# EAGLE design Cirrus (EAGLE 8.6.0)

## Sheet 1 of 4
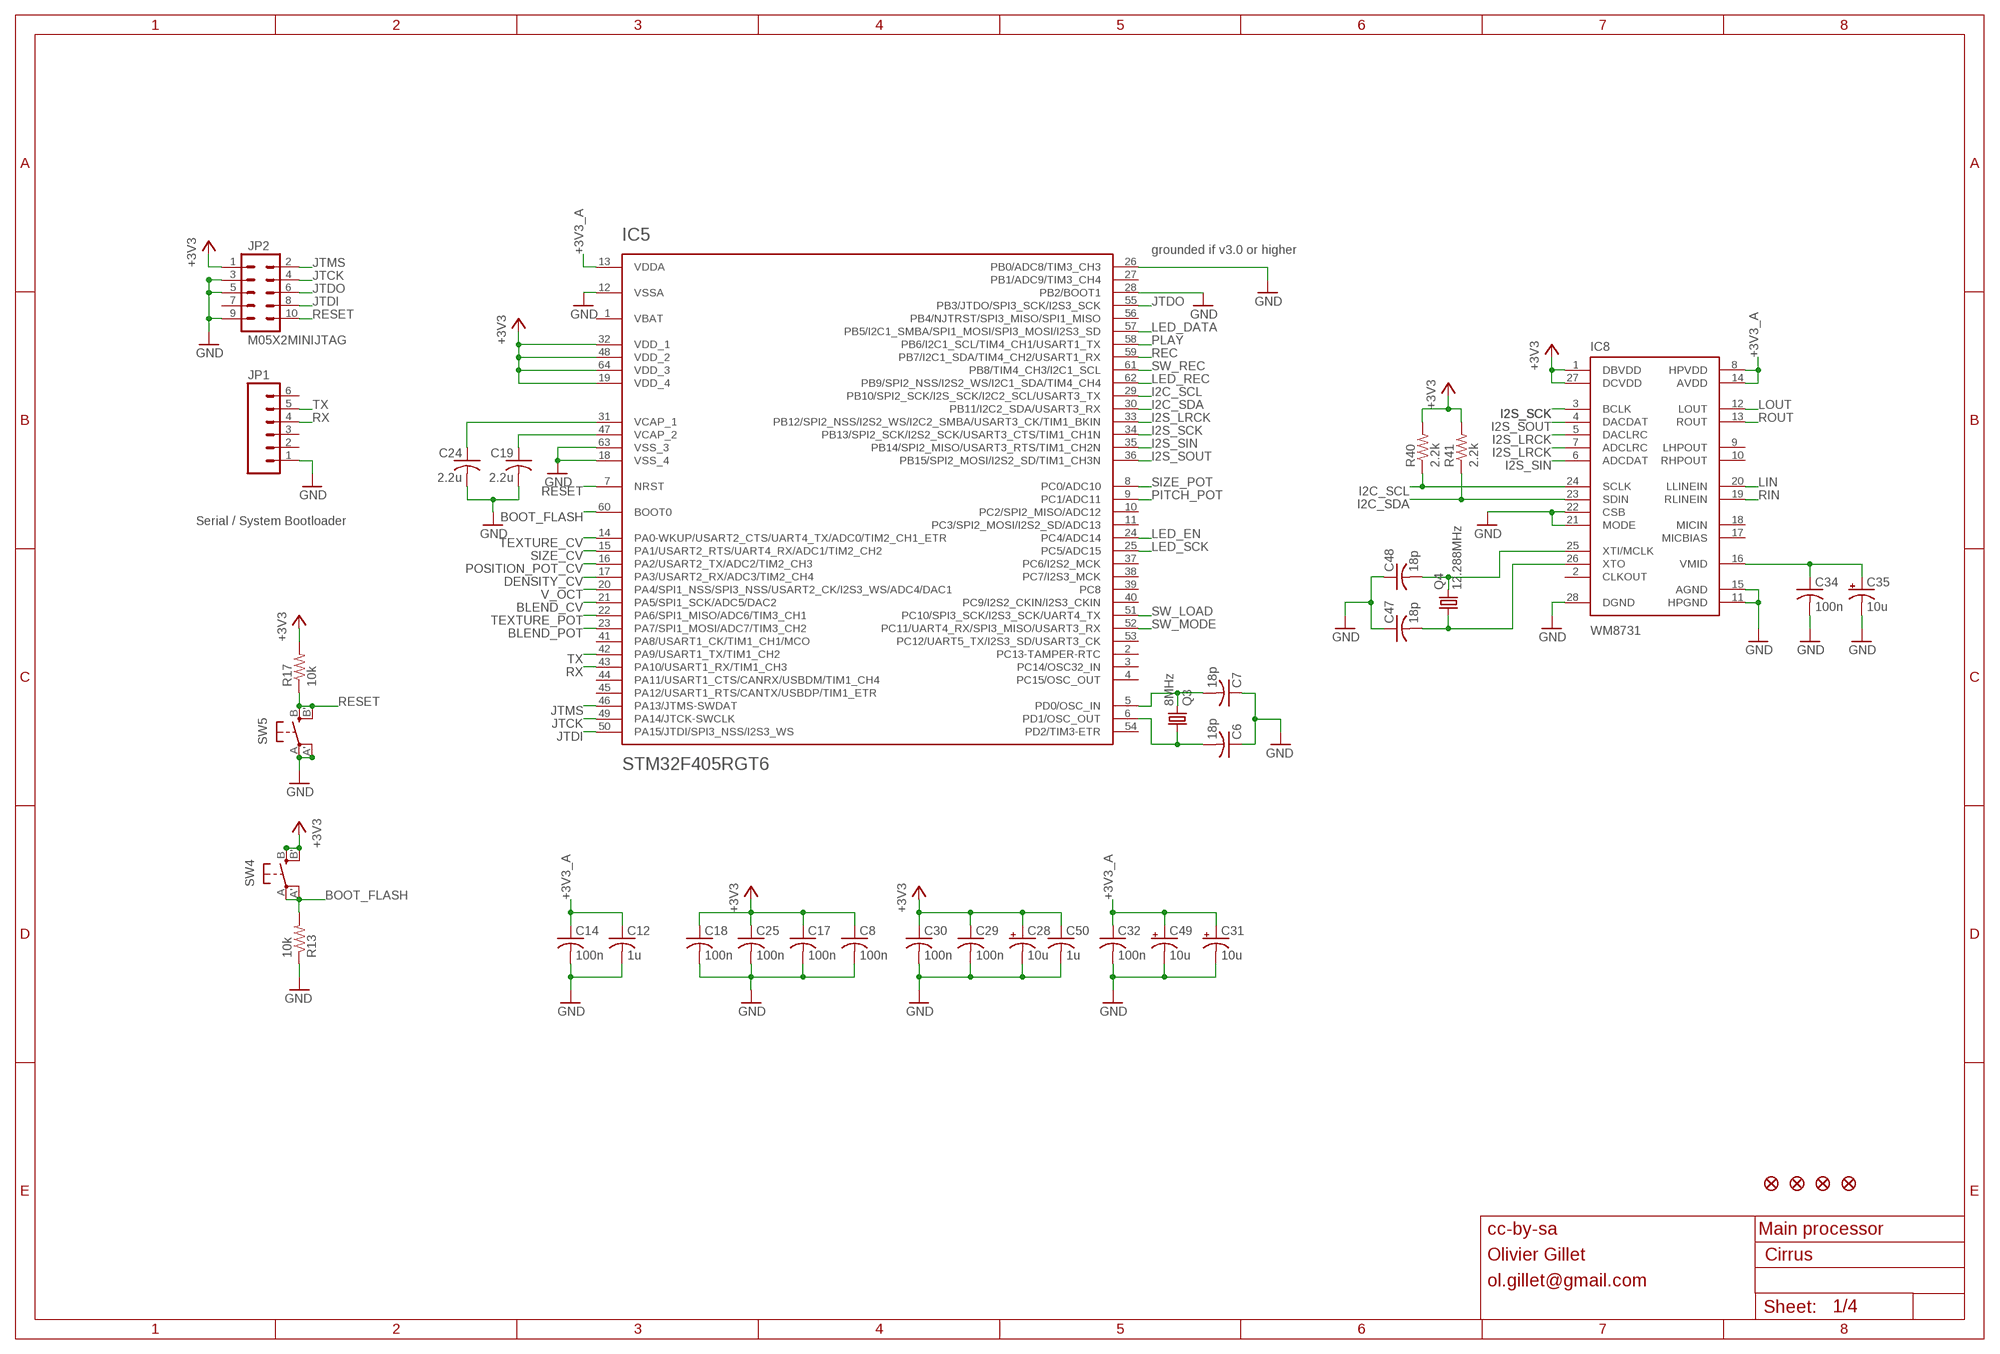
[diagram p0: schematic, sheet 1]

### Parts
C6  18p  C-USC0603  [C0603]
C7  18p  C-USC0603  [C0603]
C8  100n  C-USC0603  [C0603]
C12  1u  C-USC0603  [C0603]
C14  100n  C-USC0603  [C0603]
C17  100n  C-USC0603  [C0603]
C18  100n  C-USC0603  [C0603]
C19  2.2u  C-USC0805  [C0805]
C24  2.2u  C-USC0805  [C0805]
C25  100n  C-USC0603  [C0603]
C28  10u  CPOL-USB  [PANASONIC_B]
C29  100n  C-USC0603  [C0603]
C30  100n  C-USC0603  [C0603]
C31  10u  CPOL-USB  [PANASONIC_B]
C32  100n  C-USC0603  [C0603]
C34  100n  C-USC0603  [C0603]
C35  10u  CPOL-USB  [PANASONIC_B]
C47  18p  C-USC0603  [C0603]
C48  18p  C-USC0603  [C0603]
C49  10u  CPOL-USB  [PANASONIC_B]
C50  1u  C-USC0603  [C0603]
F1  FIDUCIAL1X2  [FIDUCIAL-1X2]
F2  FIDUCIAL1X2  [FIDUCIAL-1X2]
F3  FIDUCIAL1X2  [FIDUCIAL-1X2]
F4  FIDUCIAL1X2  [FIDUCIAL-1X2]
IC5  STM32F405RGT6  STM32F20X  [TQFP-10X10-64]
IC8  WM8731  [SSOP28]
JP1  M06SIP  [1X06]
JP2  M05X2MINIJTAG  [2X5-1.27]
Q3  8MHz  CRYSTALHC49UP  [HC49UP]
Q4  12.288MHz  CRYSTALHC49UP  [HC49UP]
R13  10k  R-US_R0603  [R0603]
R17  10k  R-US_R0603  [R0603]
R40  2.2k  R-US_R0603  [R0603]
R41  2.2k  R-US_R0603  [R0603]
SW4  EVQQ2  [EVQ-Q2]
SW5  EVQQ2  [EVQ-Q2]

### Nets
+3V3: C8.1 C17.1 C18.1 C25.1 C28.+ C29.1 C30.1 C50.1 IC5.19(VDD_4) IC5.32(VDD_1) IC5.48(VDD_2) IC5.64(VDD_3) IC8.1(DBVDD) IC8.27(DCVDD) JP2.1 R17.2 R40.2 R41.2 SW4.B'(S1) SW4.B(S) ; also sheet 3,4
+3V3_A: C12.1 C14.1 C31.+ C32.1 C49.+ IC5.13(VDDA) IC8.8(HPVDD) IC8.14(AVDD) ; also sheet 2,3,4
BLEND_CV: IC5.21(PA5/SPI1_SCK/ADC5/DAC2) ; also sheet 2
BLEND_POT: IC5.23(PA7/SPI1_MOSI/ADC7/TIM3_CH2) ; also sheet 3
BOOT_FLASH: IC5.60(BOOT0) R13.2 SW4.A'(P1) SW4.A(P)
DENSITY_CV: IC5.17(PA3/USART2_RX/ADC3/TIM2_CH4) ; also sheet 2
GND: C6.1 C7.1 C8.2 C12.2 C14.2 C17.2 C18.2 C19.2 C24.2 C25.2 C28.- C29.2 C30.2 C31.- C32.2 C34.2 C35.- C47.1 C48.1 C49.- C50.2 IC5.12(VSSA) IC5.18(VSS_4) IC5.26(PB0/ADC8/TIM3_CH3) IC5.28(PB2/BOOT1) IC5.63(VSS_3) IC8.11(HPGND) IC8.15(AGND) IC8.21(MODE) IC8.22(CSB) IC8.28(DGND) JP1.1 JP2.3 JP2.5 JP2.9 R13.1 SW5.A'(P1) SW5.A(P) ; also sheet 2,3,4
I2C_SCL: IC5.29(PB10/SPI2_SCK/I2S_SCK/I2C2_SCL/USART3_TX) IC8.24(SCLK) R40.1
I2C_SDA: IC5.30(PB11/I2C2_SDA/USART3_RX) IC8.23(SDIN) R41.1
I2S_LRCK: IC5.33(PB12/SPI2_NSS/I2S2_WS/I2C2_SMBA/USART3_CK/TIM1_BKIN) IC8.5(DACLRC) IC8.7(ADCLRC)
I2S_SCK: IC5.34(PB13/SPI2_SCK/I2S2_SCK/USART3_CTS/TIM1_CH1N) IC8.3(BCLK)
I2S_SIN: IC5.35(PB14/SPI2_MISO/USART3_RTS/TIM1_CH2N) IC8.6(ADCDAT)
I2S_SOUT: IC5.36(PB15/SPI2_MOSI/I2S2_SD/TIM1_CH3N) IC8.4(DACDAT)
JTCK: IC5.49(PA14/JTCK-SWCLK) JP2.4
JTDI: IC5.50(PA15/JTDI/SPI3_NSS/I2S3_WS) JP2.8
JTDO: IC5.55(PB3/JTDO/SPI3_SCK/I2S3_SCK) JP2.6
JTMS: IC5.46(PA13/JTMS-SWDAT) JP2.2
LED_DATA: IC5.57(PB5/I2C1_SMBA/SPI1_MOSI/SPI3_MOSI/I2S3_SD) ; also sheet 3
LED_EN: IC5.24(PC4/ADC14) ; also sheet 3
LED_REC: IC5.62(PB9/SPI2_NSS/I2S2_WS/I2C1_SDA/TIM4_CH4) ; also sheet 3
LED_SCK: IC5.25(PC5/ADC15) ; also sheet 3
LIN: IC8.20(LLINEIN) ; also sheet 2
LOUT: IC8.12(LOUT) ; also sheet 2
N$7: C7.2 IC5.5(PD0/OSC_IN) Q3.2
N$8: C6.2 IC5.6(PD1/OSC_OUT) Q3.1
N$13: C19.1 IC5.47(VCAP_2)
N$17: C34.1 C35.+ IC8.16(VMID)
N$19: C24.1 IC5.31(VCAP_1)
N$59: C47.2 IC8.26(XTO) Q4.1
N$60: C48.2 IC8.25(XTI/MCLK) Q4.2
PITCH_POT: IC5.9(PC1/ADC11) ; also sheet 3
PLAY: IC5.58(PB6/I2C1_SCL/TIM4_CH1/USART1_TX) ; also sheet 3
POSITION_POT_CV: IC5.16(PA2/USART2_TX/ADC2/TIM2_CH3) ; also sheet 2
REC: IC5.59(PB7/I2C1_SDA/TIM4_CH2/USART1_RX) ; also sheet 3
RESET: IC5.7(NRST) JP2.10 R17.1 SW5.B'(S1) SW5.B(S)
RIN: IC8.19(RLINEIN) ; also sheet 2
ROUT: IC8.13(ROUT) ; also sheet 2
RX: IC5.43(PA10/USART1_RX/TIM1_CH3) JP1.4
SIZE_CV: IC5.15(PA1/USART2_RTS/UART4_RX/ADC1/TIM2_CH2) ; also sheet 2
SIZE_POT: IC5.8(PC0/ADC10) ; also sheet 3
SW_LOAD: IC5.51(PC10/SPI3_SCK/I2S3_SCK/UART4_TX) ; also sheet 3
SW_MODE: IC5.52(PC11/UART4_RX/SPI3_MISO/USART3_RX) ; also sheet 3
SW_REC: IC5.61(PB8/TIM4_CH3/I2C1_SCL) ; also sheet 3
TEXTURE_CV: IC5.14(PA0-WKUP/USART2_CTS/UART4_TX/ADC0/TIM2_CH1_ETR) ; also sheet 2
TEXTURE_POT: IC5.22(PA6/SPI1_MISO/ADC6/TIM3_CH1) ; also sheet 3
TX: IC5.42(PA9/USART1_TX/TIM1_CH2) JP1.5
V_OCT: IC5.20(PA4/SPI1_NSS/SPI3_NSS/USART2_CK/I2S3_WS/ADC4/DAC1) ; also sheet 2
Unconnected: IC5.2(PC13-TAMPER-RTC) IC5.3(PC14/OSC32_IN) IC5.4(PC15/OSC_OUT) IC5.10(PC2/SPI2_MISO/ADC12) IC5.11(PC3/SPI2_MOSI/I2S2_SD/ADC13) IC5.27(PB1/ADC9/TIM3_CH4) IC5.37(PC6/I2S2_MCK) IC5.38(PC7/I2S3_MCK) IC5.39(PC8) IC5.40(PC9/I2S2_CKIN/I2S3_CKIN) IC5.41(PA8/USART1_CK/TIM1_CH1/MCO) IC5.44(PA11/USART1_CTS/CANRX/USBDM/TIM1_CH4) IC5.45(PA12/USART1_RTS/CANTX/USBDP/TIM1_ETR) IC5.53(PC12/UART5_TX/I2S3_SD/USART3_CK) IC5.54(PD2/TIM3-ETR) IC5.56(PB4/NJTRST/SPI3_MISO/SPI1_MISO) IC8.2(CLKOUT) IC8.9(LHPOUT) IC8.10(RHPOUT) IC8.17(MICBIAS) IC8.18(MICIN) JP1.2 JP1.3 JP1.6 JP2.7

### Notes on the sheet
- grounded if v3.0 or higher
- Serial / System Bootloader
- cc-by-sa | Main processor
- Olivier Gillet
- ol.gillet@gmail.com

## Sheet 2 of 4
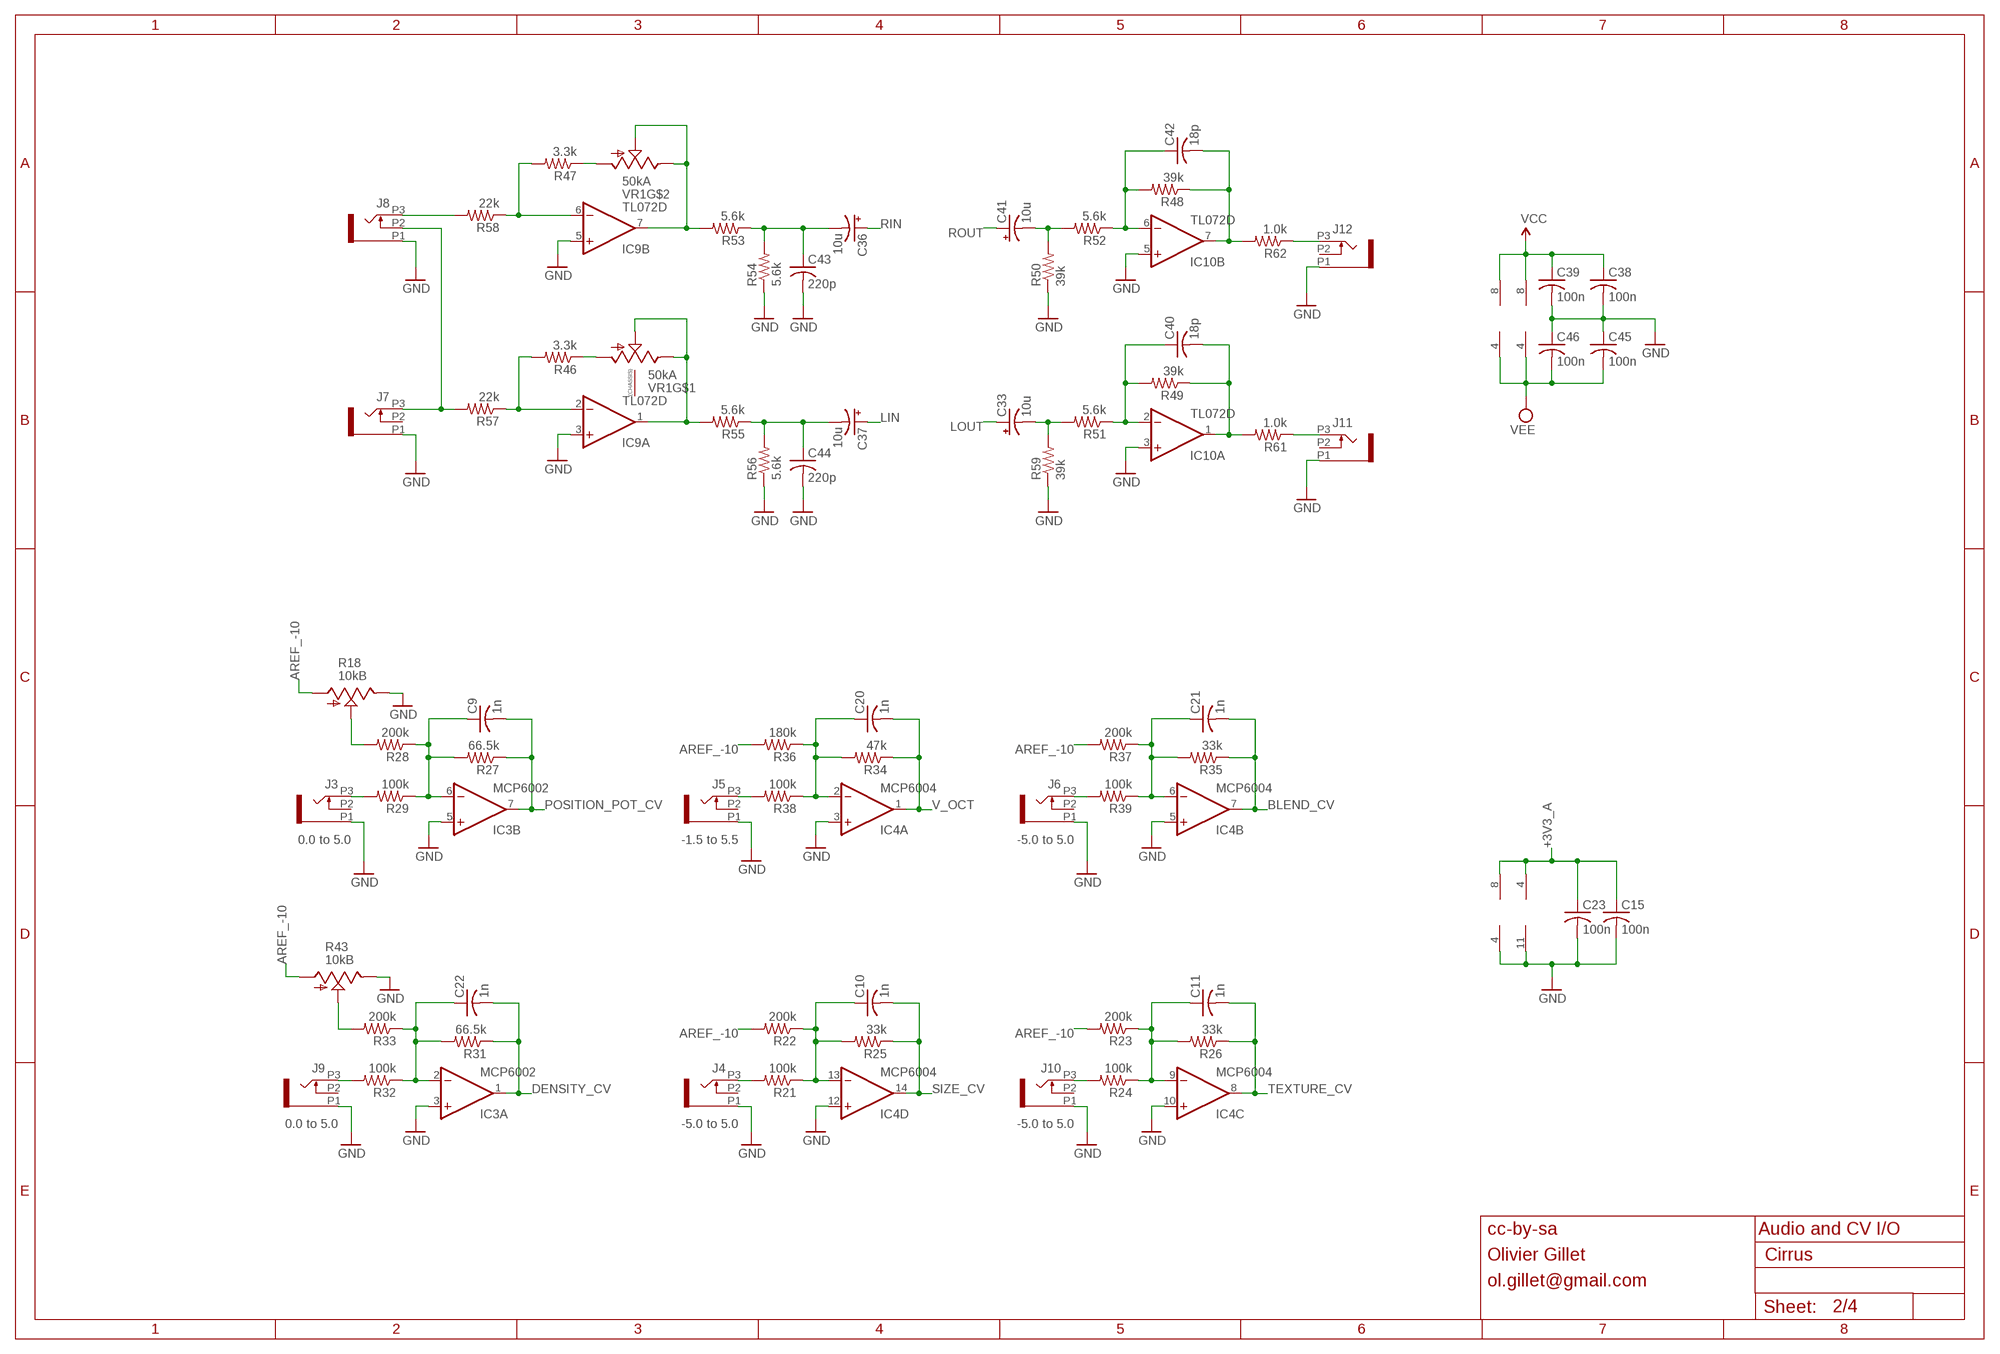
[diagram p1: schematic, sheet 2]

### Parts
C9  1n  C-USC0603  [C0603]
C10  1n  C-USC0603  [C0603]
C11  1n  C-USC0603  [C0603]
C15  100n  C-USC0603  [C0603]
C20  1n  C-USC0603  [C0603]
C21  1n  C-USC0603  [C0603]
C22  1n  C-USC0603  [C0603]
C23  100n  C-USC0603  [C0603]
C33  10u  CPOL-USB  [PANASONIC_B]
C36  10u  CPOL-USB  [PANASONIC_B]
C37  10u  CPOL-USB  [PANASONIC_B]
C38  100n  C-USC0603  [C0603]
C39  100n  C-USC0603  [C0603]
C40  18p  C-USC0603  [C0603]
C41  10u  CPOL-USB  [PANASONIC_B]
C42  18p  C-USC0603  [C0603]
C43  220p  C-USC0603  [C0603]
C44  220p  C-USC0603  [C0603]
C45  100n  C-USC0603  [C0603]
C46  100n  C-USC0603  [C0603]
IC3  MCP6002  TL072D  [SO08]
IC4  MCP6004  TL074D  [SO14]
IC9  TL072D  [SO08]
IC10  TL072D  [SO08]
J3  PJ301_THONKICONN6  [WQP_PJ_301M6]
J4  PJ301_THONKICONN6  [WQP_PJ_301M6]
J5  PJ301_THONKICONN6  [WQP_PJ_301M6]
J6  PJ301_THONKICONN6  [WQP_PJ_301M6]
J7  PJ301_THONKICONN6  [WQP_PJ_301M6]
J8  PJ301_THONKICONN6  [WQP_PJ_301M6]
J9  PJ301_THONKICONN6  [WQP_PJ_301M6]
J10  PJ301_THONKICONN6  [WQP_PJ_301M6]
J11  PJ301_THONKICONN6  [WQP_PJ_301M6]
J12  PJ301_THONKICONN6  [WQP_PJ_301M6]
R18  10kB  POT_USVERTICAL_PS  [ALPS_POT_VERTICAL_PS]
R21  100k  R-US_R0603  [R0603]
R22  200k  R-US_R0603  [R0603]
R23  200k  R-US_R0603  [R0603]
R24  100k  R-US_R0603  [R0603]
R25  33k  R-US_R0603  [R0603]
R26  33k  R-US_R0603  [R0603]
R27  66.5k  R-US_R0603  [R0603]
R28  200k  R-US_R0603  [R0603]
R29  100k  R-US_R0603  [R0603]
R31  66.5k  R-US_R0603  [R0603]
R32  100k  R-US_R0603  [R0603]
R33  200k  R-US_R0603  [R0603]
R34  47k  R-US_R0603  [R0603]
R35  33k  R-US_R0603  [R0603]
R36  180k  R-US_R0603  [R0603]
R37  200k  R-US_R0603  [R0603]
R38  100k  R-US_R0603  [R0603]
R39  100k  R-US_R0603  [R0603]
R43  10kB  POT_USVERTICAL_PS  [ALPS_POT_VERTICAL_PS]
R46  3.3k  R-US_R0603  [R0603]
R47  3.3k  R-US_R0603  [R0603]
R48  39k  R-US_R0603  [R0603]
R49  39k  R-US_R0603  [R0603]
R50  39k  R-US_R0603  [R0603]
R51  5.6k  R-US_R0603  [R0603]
R52  5.6k  R-US_R0603  [R0603]
R53  5.6k  R-US_R0603  [R0603]
R54  5.6k  R-US_R0603  [R0603]
R55  5.6k  R-US_R0603  [R0603]
R56  5.6k  R-US_R0603  [R0603]
R57  22k  R-US_R0603  [R0603]
R58  22k  R-US_R0603  [R0603]
R59  39k  R-US_R0603  [R0603]
R61  1.0k  R-US_R0603  [R0603]
R62  1.0k  R-US_R0603  [R0603]
VR1  50kA  ALPHA-9MM-DUALPOT  [DUAL_9MM_SNAP-IN_POT]

### Nets
+3V3_A: C15.1 C23.1 IC3.8(P:V+) IC4.4(P:V+) ; also sheet 1,3,4
AREF_-10: R18.P$3(A) R22.2 R23.2 R36.2 R37.2 R43.P$3(A) ; also sheet 4
BLEND_CV: C21.2 IC4.7(B:OUT) R35.1 ; also sheet 1
DENSITY_CV: C22.2 IC3.1(A:OUT) R31.1 ; also sheet 1
GND: C15.2 C23.2 C38.2 C39.2 C43.2 C44.2 C45.1 C46.1 IC3.3(A:+IN) IC3.4(P:V-) IC3.5(B:+IN) IC4.3(A:+IN) IC4.5(B:+IN) IC4.10(C:+IN) IC4.11(P:V-) IC4.12(D:+IN) IC9.3(A:+IN) IC9.5(B:+IN) IC10.3(A:+IN) IC10.5(B:+IN) J3.P1 J4.P1 J5.P1 J6.P1 J7.P1 J8.P1 J9.P1 J10.P1 J11.P1 J12.P1 R18.P$1(E) R43.P$1(E) R50.1 R54.1 R56.1 R59.1 ; also sheet 1,3,4
LIN: C37.+ ; also sheet 1
LOUT: C33.+ ; also sheet 1
LOUT_JACK: J11.P3 R61.1
N$1: J4.P3 R21.2
N$2: C10.1 IC4.13(D:-IN) R21.1 R22.1 R25.2
N$3: R47.1 VR1.1B(A)
N$4: J10.P3 R24.2
N$5: C11.1 IC4.9(C:-IN) R23.1 R24.1 R26.2
N$6: J6.P3 R39.2
N$10: J5.P3 R38.2
N$11: C20.1 IC4.2(A:-IN) R34.2 R36.1 R38.1
N$14: J9.P3 R32.2
N$15: C21.1 IC4.6(B:-IN) R35.2 R37.1 R39.1
N$18: C37.- C44.1 R55.1 R56.2
N$20: J8.P3 R58.2
N$21: J7.P3 J8.P2 R57.2
N$22: C36.- C43.1 R53.1 R54.2
N$23: C41.- R50.2 R52.2
N$24: C22.1 IC3.2(A:-IN) R31.2 R32.1 R33.1
N$25: C42.1 IC10.6(B:-IN) R48.2 R52.1
N$26: R33.2 R43.P$2(S)
N$27: J3.P3 R29.2
N$28: C42.2 IC10.7(B:OUT) R48.1 R62.2
N$30: C9.1 IC3.6(B:-IN) R27.2 R28.1 R29.1
N$31: C33.- R51.2 R59.2
N$32: C40.1 IC10.2(A:-IN) R49.2 R51.1
N$33: C40.2 IC10.1(A:OUT) R49.1 R61.2
N$35: R18.P$2(S) R28.2
N$42: IC9.7(B:OUT) R53.2 VR1.2B(S) VR1.3B(E)
N$51: IC9.1(A:OUT) R55.2 VR1.2(S) VR1.3(E)
N$52: R46.1 VR1.1(A)
N$54: IC9.6(B:-IN) R47.2 R58.1
N$58: IC9.2(A:-IN) R46.2 R57.1
POSITION_POT_CV: C9.2 IC3.7(B:OUT) R27.1 ; also sheet 1
RIN: C36.+ ; also sheet 1
ROUT: C41.+ ; also sheet 1
ROUT_JACK: J12.P3 R62.1
SIZE_CV: C10.2 IC4.14(D:OUT) R25.1 ; also sheet 1
TEXTURE_CV: C11.2 IC4.8(C:OUT) R26.1 ; also sheet 1
V_OCT: C20.2 IC4.1(A:OUT) R34.1 ; also sheet 1
VCC: C38.1 C39.1 IC9.8(P:V+) IC10.8(P:V+) ; also sheet 4
VEE: C45.2 C46.2 IC9.4(P:V-) IC10.4(P:V-) ; also sheet 4
Unconnected: J3.P2 J4.P2 J5.P2 J6.P2 J7.P2 J9.P2 J10.P2 J11.P2 J12.P2 VR1.CHASSIS1 VR1.CHASSIS2

### Notes on the sheet
- 0.0 to 5.0 | -1.5 to 5.5 | -5.0 to 5.0
- 0.0 to 5.0 | -5.0 to 5.0 | -5.0 to 5.0
- cc-by-sa | Audio and CV I/O
- Olivier Gillet
- ol.gillet@gmail.com

## Sheet 3 of 4
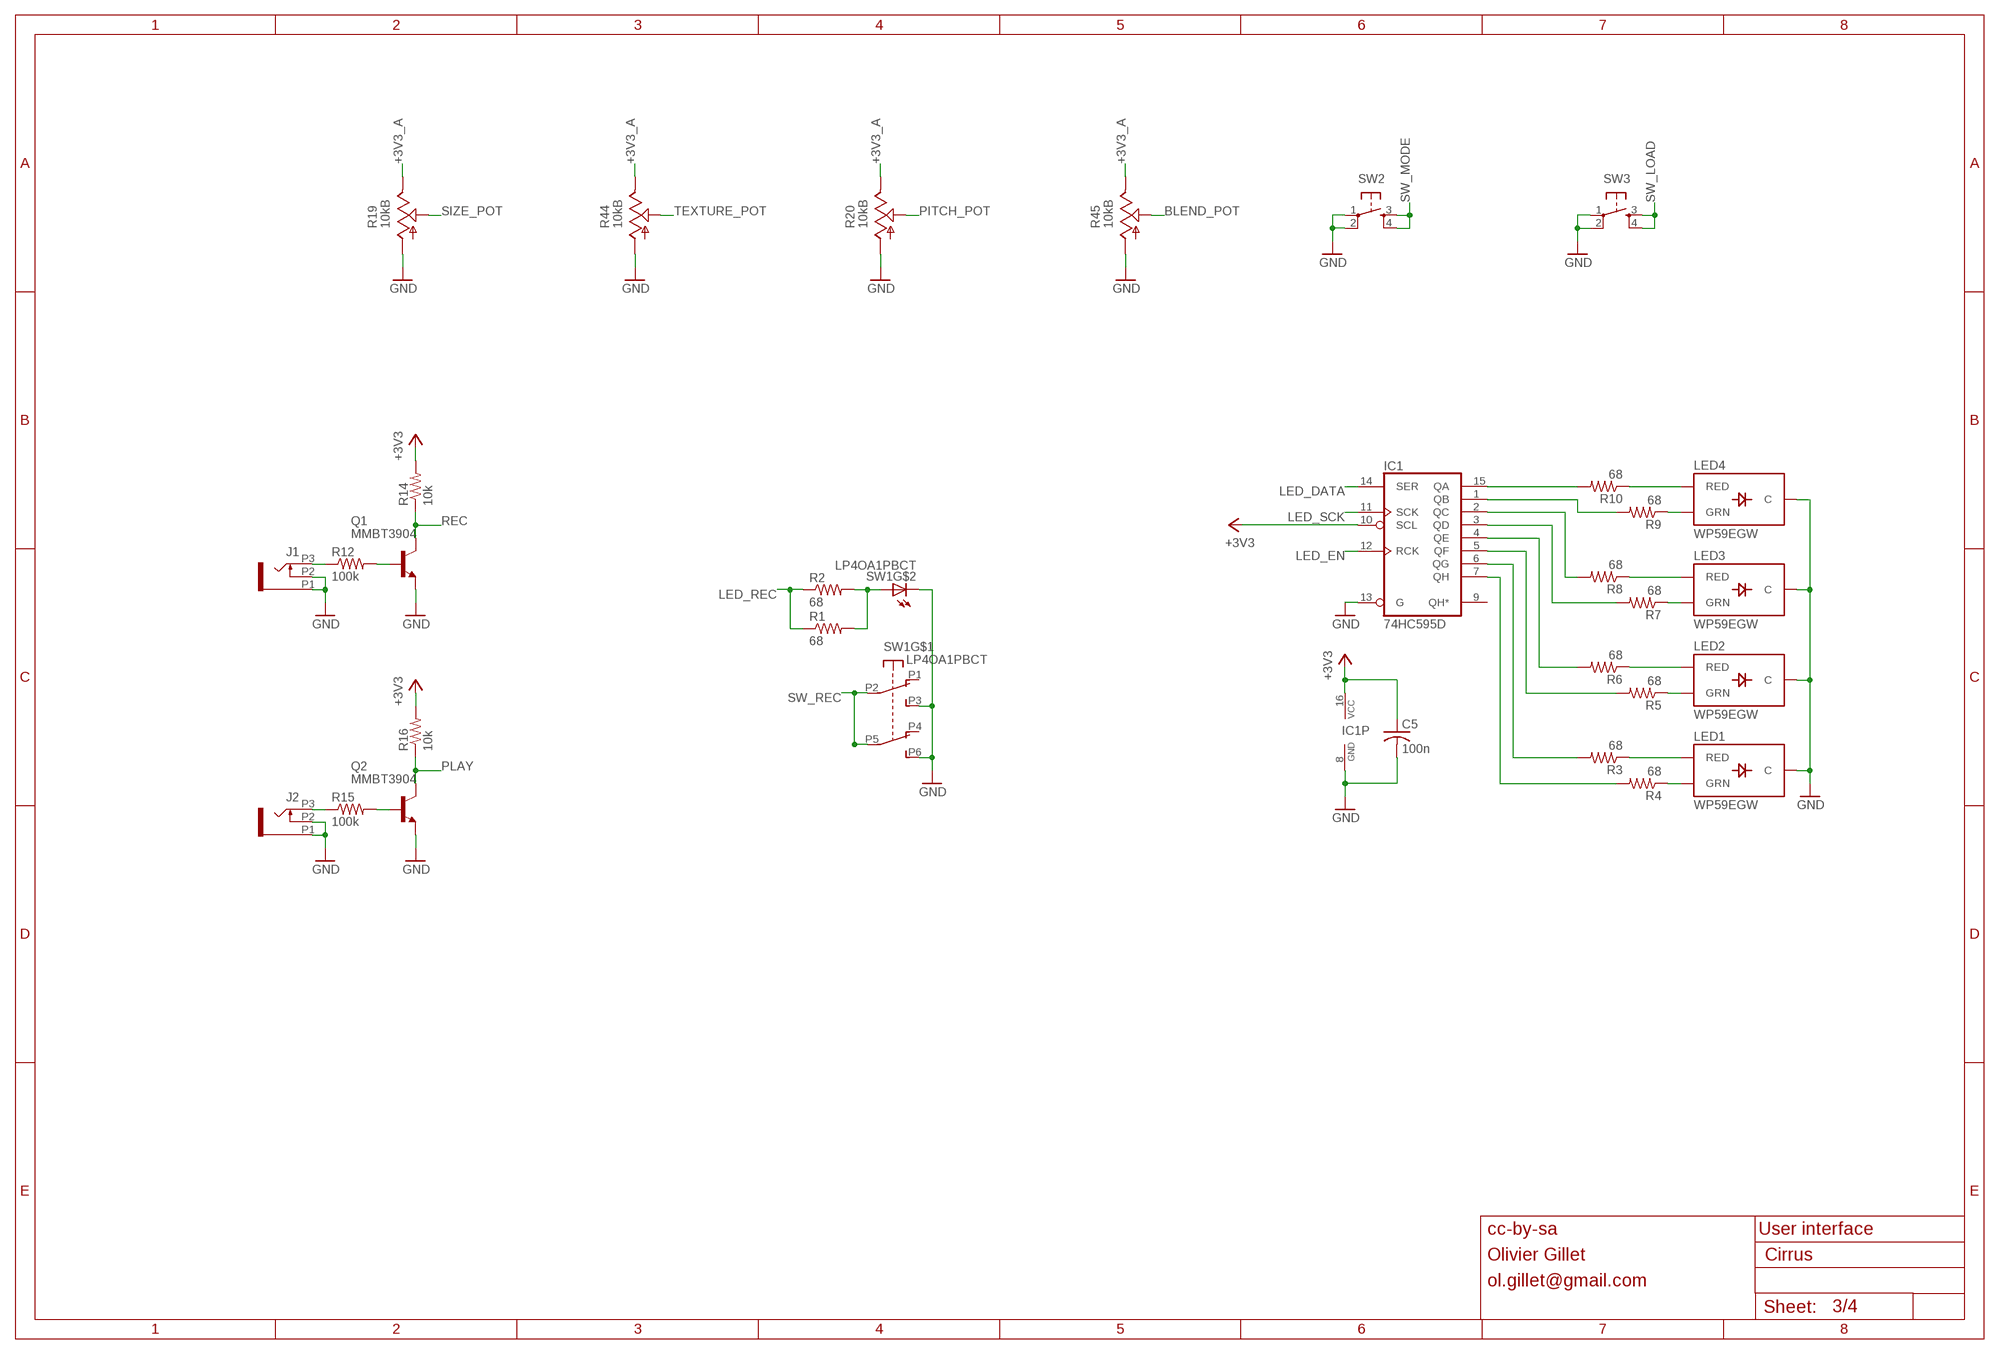
[diagram p2: schematic, sheet 3]

### Parts
C5  100n  C-USC0603  [C0603]
IC1  74HC595D  [SO16]
J1  PJ301_THONKICONN6  [WQP_PJ_301M6]
J2  PJ301_THONKICONN6  [WQP_PJ_301M6]
LED1  WP59EGW  LED-BICOLOR-THROUGHHOLE5MM  [LED-BICOLOR-THROUGHHOLE-5MM]
LED2  WP59EGW  LED-BICOLOR-THROUGHHOLE5MM  [LED-BICOLOR-THROUGHHOLE-5MM]
LED3  WP59EGW  LED-BICOLOR-THROUGHHOLE5MM  [LED-BICOLOR-THROUGHHOLE-5MM]
LED4  WP59EGW  LED-BICOLOR-THROUGHHOLE5MM  [LED-BICOLOR-THROUGHHOLE-5MM]
Q1  MMBT3904  MMBT3904LT1-NPN-SOT23-BEC  [SOT23-BEC]
Q2  MMBT3904  MMBT3904LT1-NPN-SOT23-BEC  [SOT23-BEC]
R1  68  R-US_R0603  [R0603]
R2  68  R-US_R0603  [R0603]
R3  68  R-US_R0603  [R0603]
R4  68  R-US_R0603  [R0603]
R5  68  R-US_R0603  [R0603]
R6  68  R-US_R0603  [R0603]
R7  68  R-US_R0603  [R0603]
R8  68  R-US_R0603  [R0603]
R9  68  R-US_R0603  [R0603]
R10  68  R-US_R0603  [R0603]
R12  100k  R-US_R0603  [R0603]
R14  10k  R-US_R0603  [R0603]
R15  100k  R-US_R0603  [R0603]
R16  10k  R-US_R0603  [R0603]
R19  10kB  POT_USVERTICAL_PS  [ALPS_POT_VERTICAL_PS]
R20  10kB  POT_USVERTICAL_PS  [ALPS_POT_VERTICAL_PS]
R44  10kB  POT_USVERTICAL_PS  [ALPS_POT_VERTICAL_PS]
R45  10kB  POT_USVERTICAL_PS  [ALPS_POT_VERTICAL_PS]
SW1  LP4OA1PBCT  [LP4OA1PBCT]
SW2  TAC_SWITCHPTH  [TACTILE-PTH]
SW3  TAC_SWITCHPTH  [TACTILE-PTH]

### Nets
+3V3: C5.1 IC1.10(SCL) IC1.16(VCC) R14.2 R16.2 ; also sheet 1,4
+3V3_A: R19.P$1(E) R20.P$1(E) R44.P$1(E) R45.P$1(E) ; also sheet 1,2,4
BLEND_POT: R45.P$2(S) ; also sheet 1
GND: C5.2 IC1.8(GND) IC1.13(G) J1.P1 J1.P2 J2.P1 J2.P2 LED1.2(C) LED2.2(C) LED3.2(C) LED4.2(C) Q1.E Q2.E R19.P$3(A) R20.P$3(A) R44.P$3(A) R45.P$3(A) SW1.L2 SW1.P3(A3) SW1.P6(B3) SW2.1 SW2.2 SW3.1 SW3.2 ; also sheet 1,2,4
LED_DATA: IC1.14(SER) ; also sheet 1
LED_EN: IC1.12(RCK) ; also sheet 1
LED_REC: R1.1 R2.1 ; also sheet 1
LED_SCK: IC1.11(SCK) ; also sheet 1
N$9: LED4.3(GRN) R9.1
N$12: LED4.1(RED) R10.1
N$16: LED3.1(RED) R8.1
N$29: LED3.3(GRN) R7.1
N$34: LED2.1(RED) R6.1
N$36: J2.P3 R15.1
N$37: Q2.B R15.2
N$38: R1.2 R2.2 SW1.L1
N$39: LED2.3(GRN) R5.1
N$40: LED1.1(RED) R3.1
N$41: LED1.3(GRN) R4.1
N$43: IC1.15(QA) R10.2
N$44: IC1.1(QB) R9.2
N$45: IC1.2(QC) R8.2
N$46: IC1.3(QD) R7.2
N$47: IC1.4(QE) R6.2
N$48: IC1.5(QF) R5.2
N$49: IC1.6(QG) R3.2
N$50: IC1.7(QH) R4.2
N$57: J1.P3 R12.1
N$66: Q1.B R12.2
PITCH_POT: R20.P$2(S) ; also sheet 1
PLAY: Q2.C R16.1 ; also sheet 1
REC: Q1.C R14.1 ; also sheet 1
SIZE_POT: R19.P$2(S) ; also sheet 1
SW_LOAD: SW3.3 SW3.4 ; also sheet 1
SW_MODE: SW2.3 SW2.4 ; also sheet 1
SW_REC: SW1.P2(A2) SW1.P5(B2) ; also sheet 1
TEXTURE_POT: R44.P$2(S) ; also sheet 1
Unconnected: IC1.9(QH*) SW1.P1(A1) SW1.P4(B1)

### Notes on the sheet
- cc-by-sa | User interface
- Olivier Gillet
- ol.gillet@gmail.com

## Sheet 4 of 4
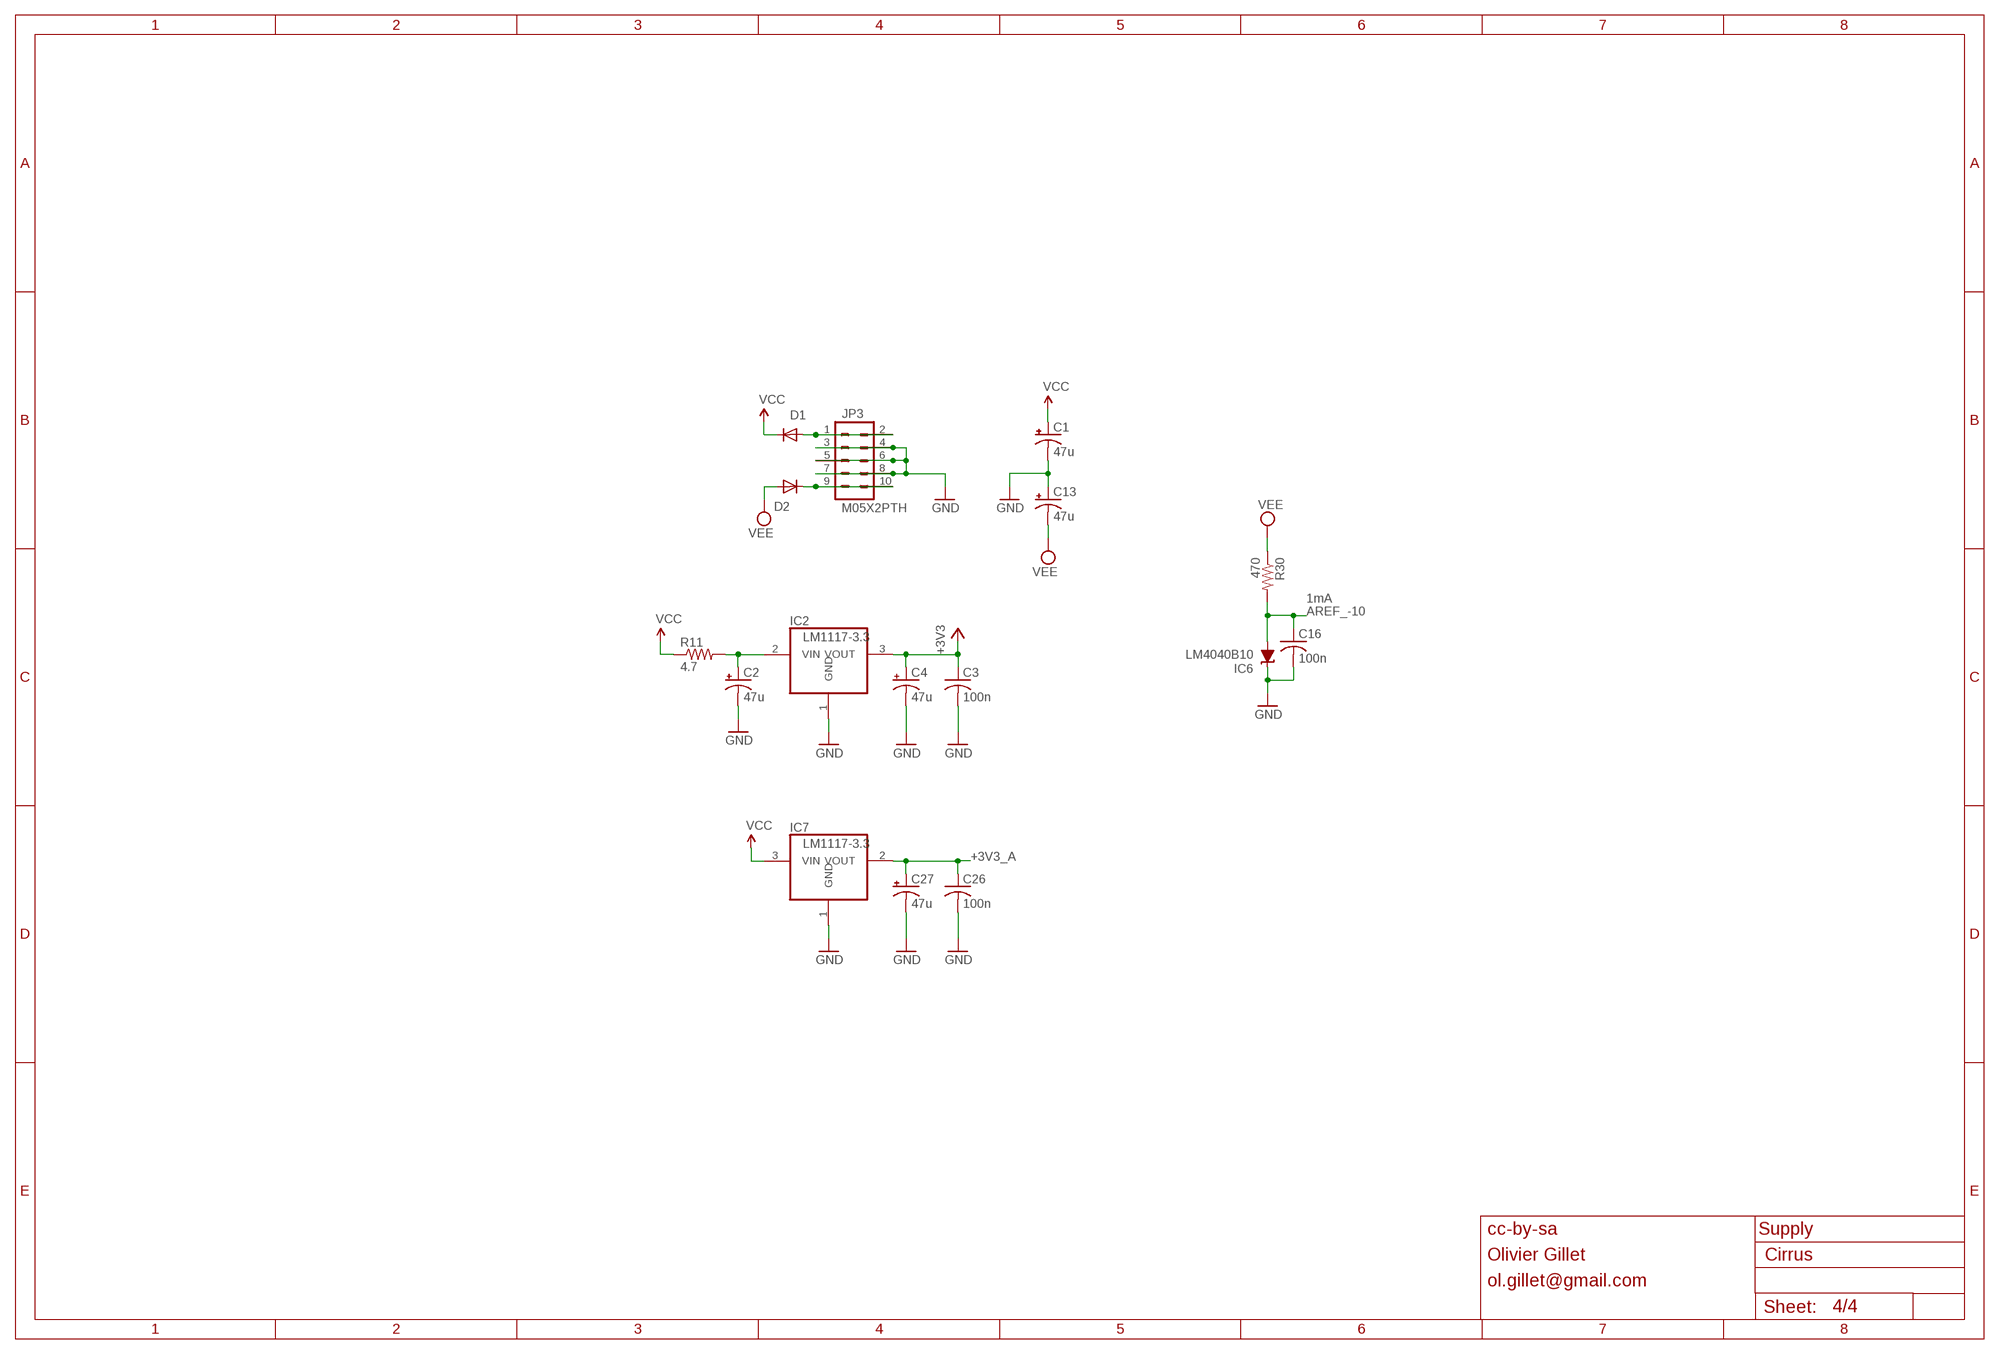
[diagram p3: schematic, sheet 4]

### Parts
C1  47u  CPOL-USD  [PANASONIC_D]
C2  47u  CPOL-USD  [PANASONIC_D]
C3  100n  C-USC0603  [C0603]
C4  47u  CPOL-USD  [PANASONIC_D]
C13  47u  CPOL-USD  [PANASONIC_D]
C16  100n  C-USC0603  [C0603]
C26  100n  C-USC0603  [C0603]
C27  47u  CPOL-USD  [PANASONIC_D]
D1  1N5819HW  DIODE-SOD123  [SOD123]
D2  1N5819HW  DIODE-SOD123  [SOD123]
IC2  LM1117-3.3  REG1117T  [TO252]
IC6  LM4040B10  LM4041B12DBZ  [DBZ_R-PDSO-G3]
IC7  LM1117-3.3  REG1117  [SOT223]
JP3  M05X2PTH  [AVR_ICSP]
R11  4.7  R-US_R1206  [R1206]
R30  470  R-US_R0603  [R0603]

### Nets
+3V3: C3.1 C4.+ IC2.3(VOUT) ; also sheet 1,3
+3V3_A: C26.1 C27.+ IC7.2(VOUT) ; also sheet 1,2,3
AREF_-10: C16.1 IC6.2(A) R30.2 ; also sheet 2
GND: C1.- C2.- C3.2 C4.- C13.+ C16.2 C26.2 C27.- IC2.1(GND) IC6.1(C) IC7.1(GND) JP3.3 JP3.4 JP3.5 JP3.6 JP3.7 JP3.8 ; also sheet 1,2,3
N$55: C2.+ IC2.2(VIN) R11.2
N$56: D1.A JP3.1 JP3.2
N$64: D2.C JP3.9 JP3.10
VCC: C1.+ D1.C IC7.3(VIN) R11.1 ; also sheet 2
VEE: C13.- D2.A R30.1 ; also sheet 2

### Notes on the sheet
- 1mA
- cc-by-sa | Supply
- Olivier Gillet
- ol.gillet@gmail.com

## Power pins joined to a net without a drawn wire
VBAT: IC5.1(VBAT)

## Library data of the parts
C1 C2 C4 C13 C27 C28 C31 C33 C35-C37 C41 = rcl:CPOL-US: POLARIZED CAPACITOR, American symbol
C3 C5-C12 C14-C26 C29 C30 C32 C34 C38-C40 C42-C48 C50 = rcl:C-US: CAPACITOR, American symbol
C49 = rcl:CPOL-US: POLARIZED CAPACITOR, American symbol; SPICEPREFIX: C
D1 D2 = diode:DIODE-: DIODE
F1-F4 = SparkFun:FIDUCIAL: Fiducial Alignment Points Various fiducial points for machine vision alignment.
IC1 = 74xx-eu:74*595: 8-bit SHIFT REGISTER, output latch
IC2 IC7 = og-vreg:REG1117: 800mA and 1A Low Dropout (LDO) Positive Regulator 1.8V, 2.5V, 2.85V, 3.3V, 5V, and Adj
IC3 = gm-ics:TL072: OP AMP
IC4 = gm-ics:TL074: OP AMP
IC5 = og-stm32f2:STM32F20X
IC6 = texas:LM4041: PRECISION MICROPOWER SHUNT VOLTAGE REFERENCE Source: http://focus.ti.com/lit/ds/slcs146e/slcs146e.pdf
IC8 = og-dac:WM8731
IC9 IC10 = og-linear:TL072: OP AMP
J1-J12 = og-pj301:PJ301_THONKICONN
JP1 = SparkFun:M06: Header 6 Standard 6-pin 0.1" header. Use with straight break away headers (SKU : PRT-00116), right angle break away headers (PRT-00553), swiss pins (PRT-00743), machine pins (PRT-00117), and female headers (PRT-00115). Molex polarized connector foot print use with SKU : PRT-08094 with associated crimp pins and housings. NOTES ON THE VARIANTS LOCK and LOCK_LONGPADS... This footprint was designed to help hold the alignment of a through-hole component (i.e. 6-pin header) while soldering it into place. You may notice that each hole has been shifted either up or down by 0.005 of an inch from it's more standard position (which is a perfectly straight line). This slight alteration caused the pins (the squares in the middle) to touch the edges of the holes. Because they are alternating, it causes a "brace" to hold the component in place. 0.005 has proven to be the perfect amount of "off-center" position when using our standard breakaway headers. Although looks a little odd when you look at the bare footprint, once you have a header in there, the alteration is very hard to notice. Also, if you push a header all the way into place, it is covered up entirely on the bottom side. This idea of altering the position of holes to aid alignment will be further integrated into the Sparkfun Library for other footprints. It can help hold any component with 3 or more connection pins.
JP2 JP3 = og-header:M05X2: Header 5x2 Standard 10-pin dual row 0.1" header. Commonly used with AVR-ISP. Use with Spark Fun Electronics SKU: PRT-00778
LED1-LED4 = og-leds:LED-BICOLOR-THROUGHHOLE
Q1 Q2 = transistor:*-NPN-: NPN Transistror BF959 corrected 2008.03.06
Q3 Q4 = crystal:CRYSTAL: CRYSTAL
R1-R17 R21-R41 R46-R59 R61 R62 = rcl:R-US_: RESISTOR, American symbol
R18-R20 R43-R45 = og-pots:POT_US
SW1 = og-switch:LP4OA1PBCT
SW2 SW3 = SparkFun:TAC_SWITCH: Momentary Switch Button commonly used for reset or general input. Spark Fun Electronics SKU : COM-00097
SW4 SW5 = adafruit:EVQQ2: SMT 6mm switch, EVQQ2 series http://www.ladyada.net/library/eagle
VR1 = MusicThingModular:ALPHA-9MM-DUALPOT: 9mm vertical snap-in pot, Alpha / Panasonic style, with a connection to the metal chassis for grounding

## Board
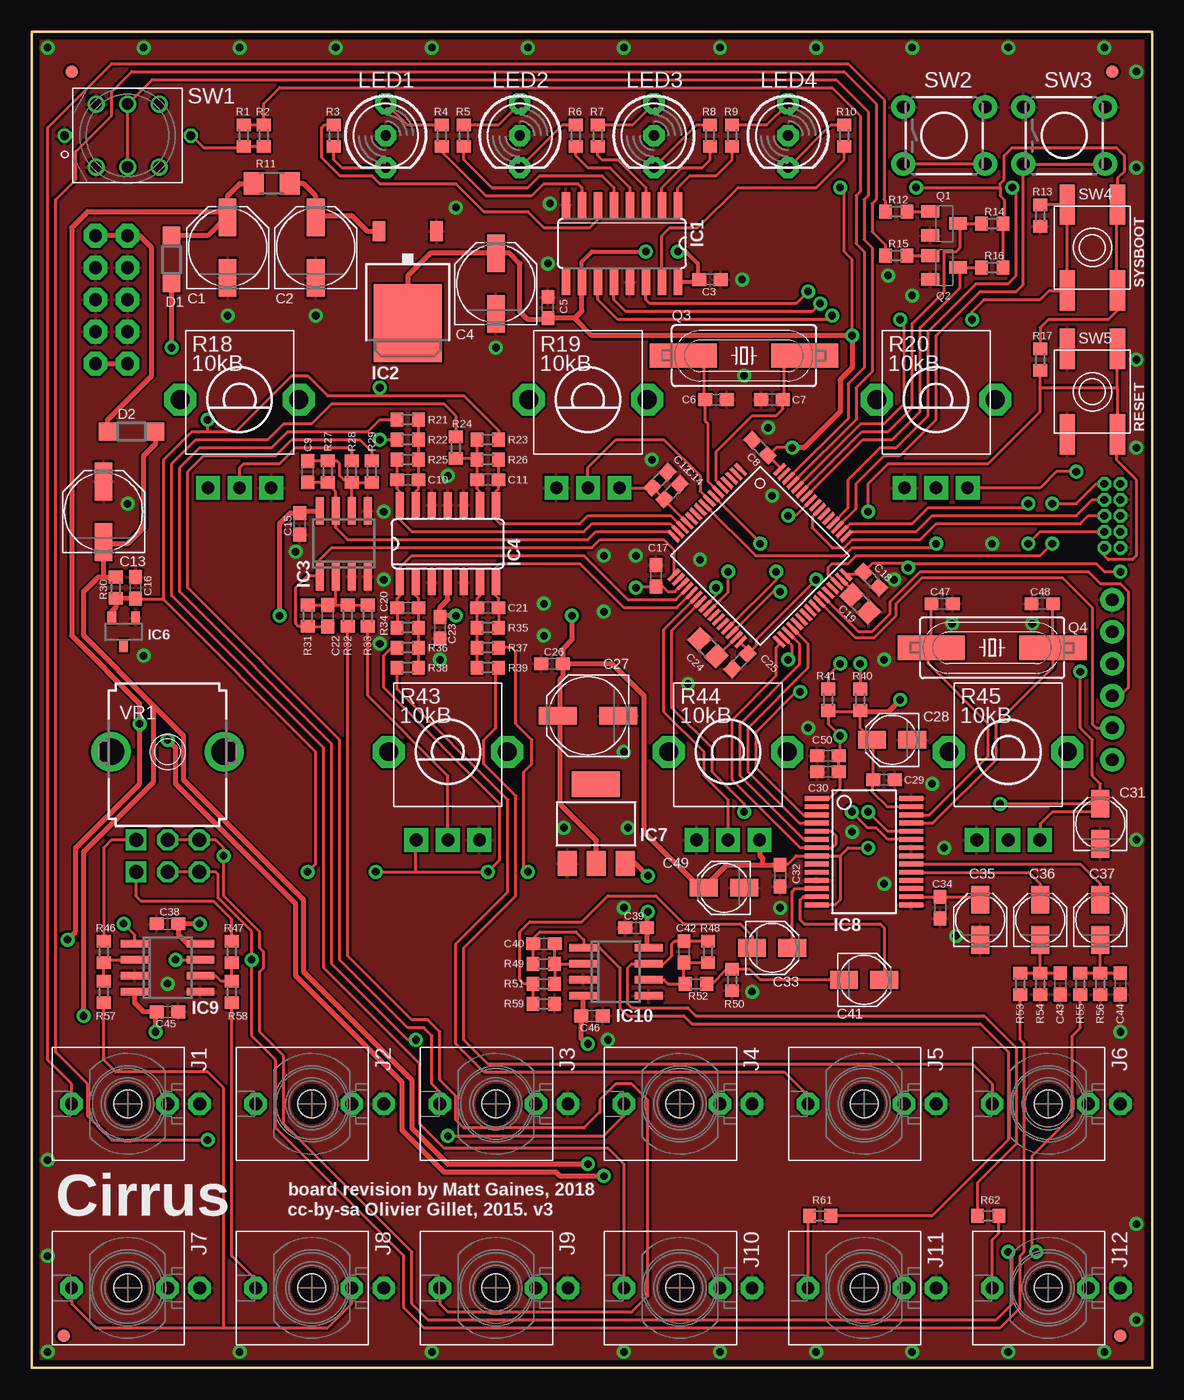
[diagram p4: board, top side]
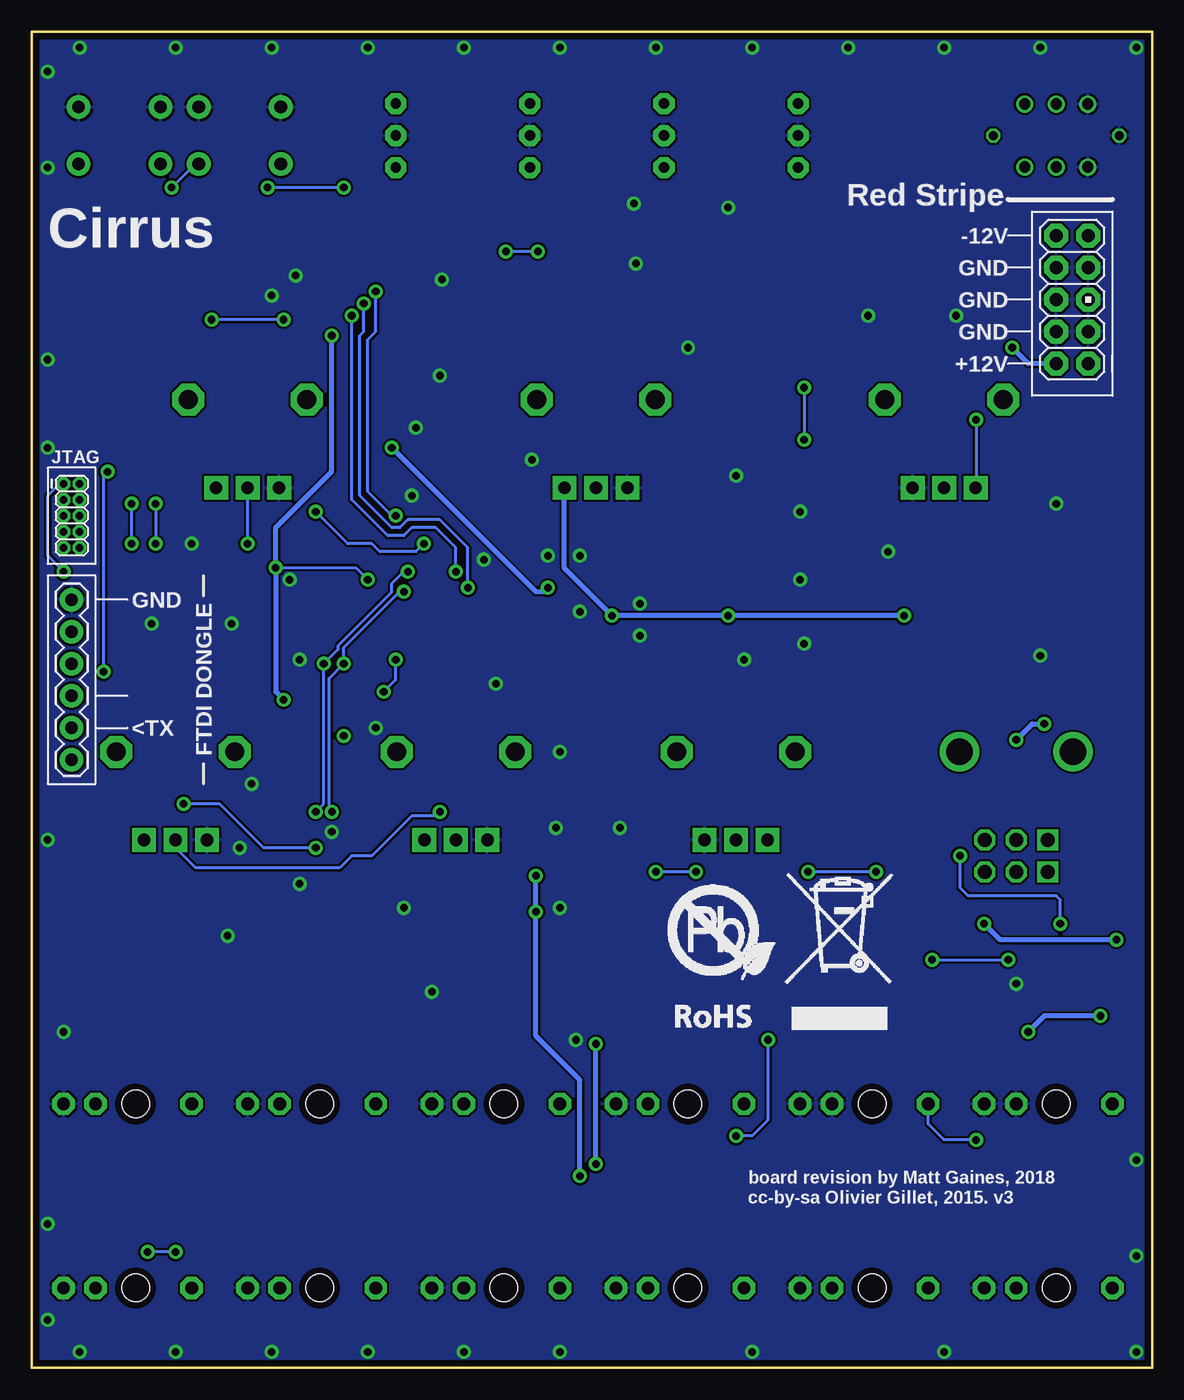
[diagram p5: board, bottom side, seen from below]

Size 88.9 x 106.05 mm. Coordinates in mm from the lower left corner, seen from the top.
Outline: 0,0 88.9,0 88.9,106.05 0,106.05 0,0
Copper layers (1*16): Top 0.035mm / dielectric 1.5mm / Bottom 0.035mm
Design rules "PCBCart-Standard-Fine": minimum track width 8mil, minimum drill 0.4mm, track to track 7mil, track to pad 7mil, pad to pad 7mil, via to via 7mil, smd to smd 7mil, copper to edge 20mil, drill to drill 8mil, minimum pad ring 8mil, minimum via ring 10mil, stop-mask expansion 3mil, vias tented up to drill 25mil, thermal gap 8mil

### Footprints (pad centres in the part's own frame; a part is rotated, then mirrored left to right if it is on the bottom)
PANASONIC_D = smd 3 x 1.4: + 2.4,0; - -2.4,0
C0603 = smd 1.1 x 1: 1 -0.85,0; 2 0.85,0
C0805 = smd 1.3 x 1.5: 1 -0.95,0; 2 0.95,0
PANASONIC_B = smd 2.2 x 1.4: + 1.6,0; - -1.6,0
SOD123 = smd 1.4 x 1.4: A 1.9,0; C -1.9,0
FIDUCIAL-1X2 = smd 1 x 1: 1 0,0
SO16 = smd 0.66 x 2.032: 1 -4.445,-3.073; 2 -3.175,-3.073; 3 -1.905,-3.073; 4 -0.635,-3.073; 5 0.635,-3.073; 6 1.905,-3.073; 7 3.175,-3.073; 8 4.445,-3.073; 9 4.445,3.073; 10 3.175,3.073; 11 1.905,3.073; 12 0.635,3.073; 13 -0.635,3.073; 14 -1.905,3.073; 15 -3.175,3.073; 16 -4.445,3.073
TO252 = smd 1 x 1.6: 1 -2.28,-4.8; 2 2.28,-4.8 | smd 5.4 x 6.2: 3 0,2.5
SO08 = smd 0.6 x 2.2: 1 -1.905,-2.6; 2 -0.635,-2.6; 3 0.635,-2.6; 4 1.905,-2.6; 5 1.905,2.6; 6 0.635,2.6; 7 -0.635,2.6; 8 -1.905,2.6
SO14 = smd 0.66 x 2.032: 1 -3.81,-3.073; 2 -2.54,-3.073; 3 -1.27,-3.073; 4 0,-3.073; 5 1.27,-3.073; 6 2.54,-3.073; 7 3.81,-3.073; 8 3.81,3.073; 9 2.54,3.073; 10 1.27,3.073; 11 0,3.073; 12 -1.27,3.073; 13 -2.54,3.073; 14 -3.81,3.073
TQFP-10X10-64 = smd 1.2 x 0.3: 1 -5.936,3.75; 2 -5.936,3.25; 3 -5.936,2.75; 4 -5.936,2.25; 5 -5.936,1.75; 6 -5.936,1.25; 7 -5.936,0.75; 8 -5.936,0.25; 9 -5.936,-0.25; 10 -5.936,-0.75; 11 -5.936,-1.25; 12 -5.936,-1.75; 13 -5.936,-2.25; 14 -5.936,-2.75; 15 -5.936,-3.25; 16 -5.936,-3.75; 33 5.886,-3.75; 34 5.886,-3.25; 35 5.886,-2.75; 36 5.886,-2.25; 37 5.886,-1.75; 38 5.886,-1.25; 39 5.886,-0.75; 40 5.886,-0.25; 41 5.886,0.25; 42 5.886,0.75; 43 5.886,1.25; 44 5.886,1.75; 45 5.886,2.25; 46 5.886,2.75; 47 5.886,3.25; 48 5.886,3.75 | smd 0.3 x 1.2: 17 -3.75,-5.911; 18 -3.25,-5.911; 19 -2.75,-5.911; 20 -2.25,-5.911; 21 -1.75,-5.911; 22 -1.25,-5.911; 23 -0.75,-5.911; 24 -0.25,-5.911; 25 0.25,-5.911; 26 0.75,-5.911; 27 1.25,-5.911; 28 1.75,-5.911; 29 2.25,-5.911; 30 2.75,-5.911; 31 3.25,-5.911; 32 3.75,-5.911; 49 3.75,5.936; 50 3.25,5.936; 51 2.75,5.936; 52 2.25,5.936; 53 1.75,5.936; 54 1.25,5.936; 55 0.75,5.936; 56 0.25,5.936; 57 -0.25,5.936; 58 -0.75,5.936; 59 -1.25,5.936; 60 -1.75,5.936; 61 -2.25,5.936; 62 -2.75,5.936; 63 -3.25,5.936; 64 -3.75,5.936
DBZ_R-PDSO-G3 = smd 0.7 x 1: 1 -0.95,-1.1; 2 0.95,-1.1; 3 0,1.1
SOT223 = smd 1.499 x 2.007: 1 -2.261,-3.15; 2 0.025,-3.15; 3 2.311,-3.15 | smd 3.81 x 2.007: 4 0,3.15
SSOP28 = smd 0.381 x 1.905: 1 -4.55,-3.752; 2 -3.9,-3.752; 3 -3.25,-3.752; 4 -2.6,-3.752; 5 -1.95,-3.752; 6 -1.3,-3.752; 7 -0.65,-3.752; 8 0,-3.752; 9 0.65,-3.752; 10 1.3,-3.752; 11 1.95,-3.752; 12 2.6,-3.752; 13 3.25,-3.752; 14 3.9,-3.752; 15 3.9,3.752; 16 3.25,3.752; 17 2.6,3.752; 18 1.95,3.752; 19 1.3,3.752; 20 0.65,3.752; 21 0,3.752; 22 -0.65,3.752; 23 -1.3,3.752; 24 -1.95,3.752; 25 -2.6,3.752; 26 -3.25,3.752; 27 -3.9,3.752; 28 -4.55,3.752
WQP_PJ_301M6 = drill 1.016 pad 1.778 octagon: P1 0,-5.715; P2 0,-3.175; P3 0,4.445 | hole 2.2: 0,0
1X06 = drill 1.016 pad 1.88: 1 0,0; 2 2.54,0; 3 5.08,0; 4 7.62,0; 5 10.16,0; 6 12.7,0
2X5-1.27 = drill 0.61 pad 1.067 octagon: 1 -1.27,3.81; 2 0,3.81; 3 -1.27,2.54; 4 0,2.54; 5 -1.27,1.27; 6 0,1.27; 7 -1.27,0; 8 0,0; 9 -1.27,-1.27; 10 0,-1.27
AVR_ICSP = drill 1.016 pad 1.88 octagon: 1 -1.27,5.08; 2 1.27,5.08; 3 -1.27,2.54; 4 1.27,2.54; 5 -1.27,0; 6 1.27,0; 7 -1.27,-2.54; 8 1.27,-2.54; 9 -1.27,-5.08; 10 1.27,-5.08
LED-BICOLOR-THROUGHHOLE-5MM = drill 0.813 pad 1.676 octagon: 1 0,2.54; 2 0,0; 3 0,-2.54
SOT23-BEC = smd 1 x 1.4: B -0.95,-1.1; C 0,1.1; E 0.95,-1.1
HC49UP = smd 5.334 x 1.93: 1 -4.826,0; 2 4.826,0
R0603 = smd 1 x 1.1: 1 -0.85,0; 2 0.85,0
R1206 = smd 1.6 x 1.803: 1 -1.422,0; 2 1.422,0
ALPS_POT_VERTICAL_PS = drill 1 pad 1.88 square: P$1 -2.5,7; P$2 0,7; P$3 2.5,7 | drill 1.5 pad 2.54 octagon: P$4 -4.7,0; P$5 4.7,0
LP4OA1PBCT = drill 0.7 octagon: L1 5,0; L2 -5,0 | drill 0.9: P1 2.5,2.5; P2 0,2.5; P3 -2.5,2.5; P4 2.5,-2.5; P5 0,-2.5; P6 -2.5,-2.5
TACTILE-PTH = drill 1.016 pad 1.88: 1 -3.251,2.261; 2 3.251,2.261; 3 -3.251,-2.261; 4 3.251,-2.261
EVQ-Q2 = smd 3.2 x 1.2: A -3.4,-2; A' 3.4,-2; B -3.4,2; B' 3.4,2
DUAL_9MM_SNAP-IN_POT = drill 1.1 square: 1 -2.5,-7; 1B -2.5,-9.54 | drill 1.1 octagon: 2 0,-7; 2B 0,-9.54; 3 2.5,-7; 3B 2.5,-9.54 | drill 2.1 pad 2.54: CHASSIS1 -4.5,0; CHASSIS2 4.5,0

### Placement (x,y rotation side)
C1  15.56,88.9 90 top
C2  22.54,88.9 90 top
C3  53.82,86.36 0 top
C4  36.83,86.04 90 top
C5  40.96,84.14 90 top
C6  54.29,76.83 180 top
C7  58.74,76.83 0 top
C8  57.79,73.03 135 top
C9  21.91,71.12 270 top
C10  29.84,70.48 180 top
C11  36.2,70.48 0 top
C12  49.85,70.48 45 top
C13  5.71,67.94 90 top
C14  50.8,69.53 45 top
C15  21.27,66.99 270 top
C16  8.26,61.91 90 top
C17  49.53,62.87 90 top
C18  66.61,62.55 315 top
C19  65.72,60.64 315 top
C20  29.84,60.33 180 top
C21  36.2,60.33 0 top
C22  23.49,59.69 270 top
C23  32.39,58.74 270 top
C24  53.66,57.15 135 top
C25  56.2,56.07 225 top
C26  41.27,55.88 180 top
C27  44.13,51.75 180 top
C28  68.26,49.85 180 top
C29  67.63,46.67 0 top
C30  63.18,47.31 180 top
C31  84.77,43.18 90 top
C32  59.37,39.05 270 top
C33  58.74,33.34 0 top
C34  72.07,36.51 270 top
C35  75.25,35.56 90 top
C36  80.01,35.56 90 top
C37  84.77,35.56 90 top
C38  10.79,35.24 180 top
C39  47.94,34.92 180 top
C40  40.64,33.66 180 top
C41  66.04,30.8 0 top
C42  51.75,33.02 90 top
C43  81.6,30.48 270 top
C44  86.36,30.48 270 top
C45  10.79,28.26 180 top
C46  44.45,27.94 180 top
C47  72.23,60.64 180 top
C48  80.17,60.64 0 top
C49  54.93,38.1 180 top
C50  63.18,48.58 180 top
D1  11.11,87.95 270 top
D2  7.94,74.3 0 top
F1  3.17,102.87 0 top
F2  85.72,102.87 0 top
F3  2.54,2.54 0 top
F4  86.36,2.54 0 top
IC1  46.83,89.22 180 top
IC2  29.84,85.41 180 top
IC3  24.76,65.41 0 top
IC4  33.02,65.41 0 top
IC5  57.79,64.45 315 top
IC6  7.3,58.42 180 top
IC7  44.77,43.18 0 top
IC8  66.04,40.64 270 top
IC9  10.79,31.75 270 top
IC10  46.36,31.43 270 top
J1  7.62,20.95 90 top
J2  22.22,20.95 90 top
J3  36.83,20.95 90 top
J4  51.44,20.95 90 top
J5  66.04,20.95 90 top
J6  80.64,20.95 90 top
J7  7.62,6.35 90 top
J8  22.22,6.35 90 top
J9  36.83,6.35 90 top
J10  51.44,6.35 90 top
J11  66.04,6.35 90 top
J12  80.64,6.35 90 top
JP1  85.72,60.96 270 bottom
JP2  85.09,66.36 0 bottom
JP3  6.35,84.77 180 bottom
LED1  28.1,97.79 180 top
LED2  38.73,97.79 180 top
LED3  49.37,97.79 180 top
LED4  60.01,97.79 180 top
Q1  72.39,90.81 270 top
Q2  72.39,87.31 270 top
Q3  56.52,80.33 0 top
Q4  76.2,57.15 0 top
R1  16.83,97.79 270 top
R2  18.41,97.79 270 top
R3  23.97,97.79 90 top
R4  32.54,97.79 270 top
R5  34.29,97.79 270 top
R6  43.18,97.79 270 top
R7  44.93,97.79 270 top
R8  53.82,97.79 270 top
R9  55.56,97.79 270 top
R10  64.45,97.79 270 top
R11  19.05,93.98 0 top
R12  68.58,91.76 0 top
R13  80.01,91.44 90 top
R14  76.2,90.81 0 top
R15  68.58,88.27 0 top
R16  76.2,87.31 0 top
R17  80.01,80.01 90 top
R18  16.51,76.83 180 top
R19  44.13,76.83 180 top
R20  71.75,76.83 180 top
R21  29.84,75.25 180 top
R22  29.84,73.66 180 top
R23  36.2,73.66 0 top
R24  33.66,73.03 90 top
R25  29.84,72.07 0 top
R26  36.2,72.07 180 top
R27  23.49,71.12 90 top
R28  25.4,71.12 90 top
R29  26.99,71.12 90 top
R30  6.67,61.91 270 top
R31  21.91,59.69 90 top
R32  25.08,59.69 270 top
R33  26.67,59.69 270 top
R34  29.84,58.74 0 top
R35  36.2,58.74 180 top
R36  29.84,57.15 180 top
R37  36.2,57.15 0 top
R38  29.84,55.56 180 top
R39  36.2,55.56 0 top
R40  65.72,53.02 270 top
R41  63.18,53.02 270 top
R43  33.02,48.9 180 top
R44  55.25,48.9 180 top
R45  77.47,48.9 180 top
R46  5.71,33.02 270 top
R47  15.88,33.02 270 top
R48  53.66,33.02 270 top
R49  40.64,32.07 0 top
R50  55.56,30.8 90 top
R51  40.64,30.48 180 top
R52  52.71,30.48 0 top
R53  78.42,30.48 270 top
R54  80.01,30.48 90 top
R55  83.18,30.48 270 top
R56  84.77,30.48 90 top
R57  5.71,29.84 270 top
R58  15.88,29.84 270 top
R59  40.64,28.89 180 top
R61  62.55,12.06 0 top
R62  75.88,12.06 180 top
SW1  7.62,97.79 0 top
SW2  72.39,97.79 0 top
SW3  81.91,97.79 0 top
SW4  84.14,88.9 270 top
SW5  84.14,77.47 270 top
U$2  [ROHS_BIG]  39.69,26.04 0 bottom
VR1  10.79,48.9 0 top

### Tracks (layer width: path | path; a pad name or v marks a point on that pad's centre or on a via)
+3V3  (via drill 0.6)
  Top 0.254: IC5.19 51.04,61.59 50.48,61.59 50.06,62.02 C17.1 48.05,62.02 v47.94,61.91 | R17.2 80.01,82.55 80.64,83.19 85.41,83.19 86.14,83.92 86.04,84.01 86.04,85.59 | IC5.32 56.26,57.53 56.8,56.99 C25.1 57.47,57.34 57.47,57.78 v62.23,62.55 | IC5.64 59.33,71.48 C8.1 58.45,72.42 59.05,73.03 v60.33,73.03 | IC1.16 51.38,86.04 | 86.04,85.59 SW4.B' | 86.04,85.59 86.04,92.39 SW4.B 86.14,94.39 86.68,94.93 86.68,96.2 86.04,96.84 77.79,96.84 77.15,96.2 77.15,94.3 76.83,93.98 76.83,93.66 | IC5.48 65.8,62.94 C18.1 66.68,63.82 69.53,63.82 | v69.53,63.5 69.53,63.82 | 76.83,93.66 76.83,93.03 77.15,92.71 77.15,90.91 R14.2 R16.2 | v65.09,81.92 65.09,87.95 64.45,88.58 64.45,93.34 v64.13,93.66 | v70.17,93.66 76.83,93.66 | 69.53,63.82 84.45,63.82 85.09,63.18 v86.36,63.18 | IC8.27 67.85,44.54 66.67,45.72 66.67,46.57 C29.1 66.78,49.73 C28.+ 65.72,50.79 65.72,52.07 | IC8.1 63.29,45.19 64.13,46.04 64.13,47.2 C30.1 C50.1 64.13,48.68 v64.13,50.16 63.18,51.12 R41.2 63.29,52.07 65.72,52.07 | 65.72,52.07 R40.2
  Top 0.305: 52.86,86.46 C3.1 | 52.86,86.46 52.86,87.63 51.91,88.58 v51.28,88.58 | 52.86,86.46 52.55,86.14 IC1.16 | v48.74,88.58 44.45,88.58 43.66,87.79 IC1.10
  Top 0.406: v60.33,73.03 61.28,73.03 64.13,75.88 64.13,78.42 65.09,79.38 v65.09,81.92 44.45,81.92 43.08,83.29 | IC2.3 29.84,86.68 31.61,88.44 C4.+ 37.92,88.44 38.73,87.63 38.73,83.82 39.37,83.19 40.86,83.19 C5.1 43.08,83.29 | 43.08,83.29 43.66,83.87 IC1.10 | v68.9,53.02 67.94,52.07 65.72,52.07
  Bottom 0.254: v48.74,88.58 v51.28,88.58 | v62.23,62.55 63.18,63.5 v69.53,63.5 | v64.13,93.66 v70.17,93.66 | v86.36,63.18 87.63,64.45 87.63,69.22 86.68,70.17 JP2.1
  Bottom 0.406: v60.33,73.03 48.9,61.59 48.26,61.59 v47.94,61.91 | v65.09,81.92 65.09,71.12 69.53,66.67 v69.53,63.5 69.53,53.66 v68.9,53.02
+3V3_A  (via drill 0.6)
  Top 0.254: 64.13,40.64 IC8.8 60.64,40.64 60.01,40.01 59.48,40.01 C32.1 | IC8.14 63.73,36.74 64.13,37.15 64.13,40.64 | 64.13,40.64 64.77,41.27 v66.36,41.27 | IC5.13 50.2,68.86 C14.1 C12.1 49.2,69.83 R19.P$1 | v82.87,71.12 81.28,71.12 79.99,69.83 R20.P$1 | v83.18,55.24 83.18,50.8 84.14,49.85 84.14,46.99 84.77,46.35 C31.+ | R45.P$1 80.01,41.94 80.01,43.18 80.96,44.13 84.77,44.13 C31.+ | v76.83,44.77 76.85,44.78 C31.+
  Top 0.406: IC7.2 44.77,40.06 44.77,41.91 41.91,44.77 41.91,51.58 C27.+ 41.91,51.93 41.91,54.61 42.12,54.83 C26.1 | v19.68,59.69 19.68,66.99 20.54,67.84 C15.1 21.43,68 IC3.8 | v33.66,59.69 32.49,59.69 C23.1 32.39,60.33 33.02,60.96 IC4.4 | v42.86,59.69 42.86,57.78 42.12,57.05 C26.1 | C26.1 46.04,55.88 48.58,53.34 48.58,42.55 53.02,38.1 C49.+ 55.13,39.9 58,39.9 | 58,39.9 C32.1 | R44.P$1 57.79,41.85 57.79,40.64 58,40.42 58,39.9
  Bottom 0.254: v66.36,41.27 70.48,41.27 73.98,44.77 v76.83,44.77 | v83.18,55.24 83.18,70.8 v82.87,71.12
  Bottom 0.406: v19.68,59.69 v33.66,59.69 v42.86,59.69 46.63,63.46 R19.P$1
AREF_-10  (via drill 0.6)
  Top 0.254: 8.47,61.28 C16.1 8.36,60.96 10.48,60.96 | v27.62,73.66 R22.2 | 27.62,77.15 v27.62,77.79 | 27.62,77.15 34.29,77.15 37.05,74.4 R23.2 | 13.97,74.3 12.7,74.3 10.48,72.07 10.48,60.96 | 13.97,74.3 16.19,74.3 20.64,78.74 21.91,78.74 23.49,77.15 27.62,77.15 | v27.3,39.37 30.48,39.37 | 30.48,39.37 v36.2,39.37 37.15,40.32 37.15,44.77 27.94,53.98 27.94,56.52 28.57,57.15 R36.2 | R43.P$3 30.48,41.85 30.48,39.37 | R37.2 38.1,57.15 38.42,56.83 38.42,51.12 39.69,49.85 39.69,47.94 39.05,47.31 39.05,39.69 v39.37,39.37 | 13.97,74.3 v13.97,75.25 | 10.48,60.96 22.54,48.9 22.54,40.01 v21.91,39.37
  Top 0.406: C16.1 R30.2 6.67,60.33 6.35,60.01 IC6.2
  Bottom 0.254: v27.62,77.79 v27.62,73.66 | v21.91,39.37 v27.3,39.37 | v36.2,39.37 v39.37,39.37 | R18.P$3 13.97,69.88 v13.97,75.25
BLEND_CV
  Top 0.254: IC5.21 51.18,60.33 46.99,60.33 43.5,63.82 37.15,63.82 36.83,63.5 IC4.7 36.83,61.28 37.05,61.06 C21.2 R35.1
BLEND_POT  (via drill 0.6)
  Top 0.254: IC5.23 50.8,58.53 50.8,52.39 53.98,49.21 53.98,47.31 56.52,44.77 v56.52,44.13
  Bottom 0.254: v56.52,44.13 56.83,43.81 58.74,43.81 61.91,40.64 63.5,40.64 64.45,39.69 75.88,39.69 77.47,41.27 R45.P$2
BOOT_FLASH  (via drill 0.6)
  Top 0.254: R13.2 80.02,92.3 SW4.A SW4.A' 80.74,85.5 80.01,84.77 75.56,84.77 74.61,83.82 v74.61,83.19 | IC5.60 65.79,74.93 67.63,74.93 69.21,76.52 69.21,82.87 v68.9,83.19
  Bottom 0.254: v68.9,83.19 v74.61,83.19
DENSITY_CV
  Top 0.254: C22.2 R31.1 21.17,58.84 20.95,59.05 20.95,61.91 21.91,62.87 22.8,62.87 IC3.1 22.86,64.14 23.81,65.09 44.45,65.09 45.09,65.72 50.16,65.72 50.95,64.93 IC5.17
GND  (via drill 0.6)
  other vias: 10.79,30.48 86.36,26.67 57.15,29.84 41.12,92.39 33.02,70.8 27.94,67.94 27.94,62.55 32.39,56.2 47.94,64.45 73.34,34.29 52.07,54.29 68.42,62.55 58.42,74.61 15.56,83.5 45.72,26.04 46.99,36.51 20.95,64.77 46.99,48.9 61.59,50.8 67.63,56.2 71.44,46.35 72.39,41.27 49.21,72.07 56.52,78.74 1.27,104.78 8.89,104.78 16.51,104.78 24.13,104.78 31.75,104.78 39.37,104.78 46.99,104.78 54.61,104.78 62.23,104.78 69.85,104.78 77.47,104.78 85.09,104.78 87.63,102.87 87.63,95.25 87.63,41.91 87.63,3.81 87.63,11.43 85.09,1.27 77.47,1.27 69.85,1.27 62.23,1.27 54.61,1.27 46.99,1.27 31.75,1.27 16.51,1.27 1.27,1.27 1.27,8.89 1.27,16.51 87.63,80.01 87.63,73.03 40.64,58.1 40.64,60.64 27.62,57.47 65.09,42.55 67.63,38.42 73.02,59.05 76.2,65.41 79.38,59.05 67.94,86.68 69.85,85.09 58.74,69.22 45.4,60.01 45.4,64.45 53.02,64.14 42.23,42.86 47.31,42.86 33.66,92.08 36.83,80.96 40.96,87.63 7.62,68.58 8.89,56.52 56.36,86.36 22.54,83.5 59.37,36.51
  pour Bottom: 0,106.05 0,0 88.9,0 88.9,106.05
  pour Top: 0,106.05 88.9,106.05 88.9,0 0,0
I2C_SCL  (via drill 0.6)
  Top 0.254: IC5.29 59.05,62.54 v59.05,63.18 | 69.84,42.55 IC8.24 67.9,42.59 v66.36,44.13 | 66.04,54.19 R40.1 v65.72,55.88
  Bottom 0.254: v66.36,44.13 65.72,44.77 v65.72,55.88 64.57,57.04 64.57,57.33 60.33,61.57 60.33,62.23 59.37,63.18 v59.05,63.18
I2C_SDA  (via drill 0.6)
  Top 0.254: IC5.30 58.82,61.59 v59.37,61.59 | IC8.23 67.91,41.94 66.99,42.86 66.34,42.86 v65.07,44.13 | v64.13,55.88 63.18,54.93 R41.1
  Bottom 0.254: v59.37,61.59 59.69,61.59 64.13,57.15 v64.13,55.88 65.29,54.72 65.29,44.65 65.07,44.43 v65.07,44.13
I2S_LRCK
  Top 0.254: 62.24,42.55 IC8.5 63.46,42.59 63.82,42.23 63.82,41.59 63.5,41.27 62.3,41.27 IC8.7 60.95,41.29 55.56,46.67 55.56,51.44 59.05,54.93 59.05,57.15 59.3,57.39 IC5.33
I2S_SCK  (via drill 0.6)
  Top 0.254: IC8.3 61.2,43.89 57.47,47.62 57.47,50.48 60.64,53.66 v60.96,53.66 | v60.01,56.2 60.33,56.52 60.33,57.32 IC5.34
  Bottom 0.254: v60.96,53.66 60.01,54.61 v60.01,56.2
I2S_SIN
  Top 0.254: 62.32,41.91 IC8.6 61.25,41.94 56.2,46.99 56.2,51.12 60.92,55.84 60.92,57.43 IC5.35
I2S_SOUT
  Top 0.254: 62.35,43.18 IC8.4 60.9,43.24 56.83,47.31 56.83,50.8 61.59,55.56 61.59,57.46 IC5.36
JTCK
  Top 0.254: IC5.49 64.99,66.36 70.17,66.36 71.44,67.63 82.87,67.63 84.14,68.9 JP2.4
JTDI  (via drill 0.6)
  Top 0.254: IC5.50 64.92,66.99 69.85,66.99 71.12,68.26 78.74,68.26 v79.06,68.58 | JP2.8 80.01,66.36 v79.06,65.41
  Bottom 0.254: v79.06,68.58 v79.06,65.41
JTDO
  Top 0.254: IC5.55 61.91,67.52 61.91,66.67 63.5,65.09 64.45,65.09 65.09,65.72 70.48,65.72 71.75,66.99 83.18,66.99 83.82,67.63 JP2.6
JTMS  (via drill 0.6)
  Top 0.254: IC5.46 63.18,62.94 63.18,63.5 63.5,63.82 64.77,63.82 65.41,64.45 80.01,64.45 v80.96,65.41 | v80.96,68.58 82.87,68.58 84.45,70.17 JP2.2
  Bottom 0.254: v80.96,65.41 v80.96,68.58
LED_DATA  (via drill 0.6)
  Top 0.254: IC1.14 48.74,84.77 49.05,84.45 60.64,84.45 v61.59,85.41 | 60.33,67.63 v60.01,67.63 60.61,67.63 IC5.57
  Bottom 0.254: v61.59,85.41 61.59,82.23 62.23,81.6 62.23,69.53 60.33,67.63 v60.01,67.63
LED_EN  (via drill 0.6)
  Top 0.254: IC1.12 46.2,84.77 47.15,83.82 61.91,83.82 v62.55,84.45 | IC5.24 54.29,61.31 v54.29,61.91
  Bottom 0.254: v62.55,84.45 62.55,82.23 62.87,81.92 62.87,69.22 60.33,66.67 59.69,66.67 59.05,67.31 56.52,67.31 54.29,65.09 v54.29,61.91
LED_REC
  Top 0.254: IC5.62 64.77,75.33 64.77,78.11 66.04,79.38 66.04,88.58 65.41,89.22 65.41,93.03 65.72,93.34 65.72,99.38 63.5,101.6 19.68,101.6 18.41,100.33 R2.1 R1.1
LED_SCK  (via drill 0.6)
  Top 0.254: IC1.11 | IC1.11 44.93,84.77 46.51,83.19 63.18,83.19 v63.5,83.5 | IC5.25 55.25,61.56 v55.25,63.18
  Bottom 0.254: v63.5,83.5 63.5,68.9 60.64,66.04 59.37,66.04 58.74,66.67 56.83,66.67 55.25,65.09 v55.25,63.18
LIN
  Top 0.254: C37.+ 84.77,38.42 83.2,39.99 IC8.20
LOUT
  Top 0.254: C33.+ 60.33,37.78 60.58,38.04 IC8.12
LOUT_JACK
  Top 0.254: R61.1 61.59,11.96 J11.P3
N$1  (via drill 0.6)
  Top 0.254: R21.2 27.62,75.25 26.67,74.3 20.32,74.3 19.05,73.03 13.34,73.03 11.75,71.44 11.75,61.59 23.81,49.53 23.81,32.07 29.84,26.04 v30.48,26.04 | v33.02,18.41 45.4,18.41 46.99,20 J4.P3
  Bottom 0.254: v30.48,26.04 30.48,19.68 31.75,18.41 v33.02,18.41
N$2
  Top 0.254: IC4.13 30.48,69.53 30.69,69.75 C10.1 R25.2 R22.1 R21.1
N$3
  Top 0.254: R47.1 15.88,35.61 14.47,37.01 8.71,37.01 8.26,37.47 8.29,37.51 VR1.1B
N$4
  Top 0.254: R24.2 33.66,75.56 32.7,76.52 23.81,76.52 22.22,74.93 20,74.93 18.73,73.66 13.02,73.66 11.11,71.75 11.11,61.28 23.18,49.21 23.18,31.75 30.8,24.13 30.8,19.37 32.7,17.46 45.72,17.46 46.99,16.19 J10.P3
N$5
  Top 0.254: R26.2 R23.1 | R26.2 C11.1 35.34,69.75 35.56,69.53 IC4.9 | R26.2 35.24,72.17 R24.1
N$6
  Top 0.254: R39.2 36.83,55.35 36.83,50.8 35.88,49.85 35.88,47.94 38.42,45.4 38.42,37.47 34.29,33.34 34.29,26.04 36.2,24.13 74.61,24.13 76.2,22.54 J6.P3
N$7
  Top 0.254: IC5.5 54.29,70.42 54.29,72.71 57.15,75.56 59.05,75.56 59.59,76.1 C7.2 59.69,76.94 59.69,80.01 60.01,80.33 Q3.2
N$8
  Top 0.254: IC5.6 53.66,70.35 53.66,74.93 53.44,75.14 C6.2 53.34,76.94 53.34,79.38 52.39,80.33 Q3.1
N$9
  Top 0.254: LED4.3 58.32,98.64 R9.1
N$10
  Top 0.254: R38.2 28.99,53.87 37.78,45.09 37.78,37.78 33.66,33.66 33.66,25.72 35.88,23.5 59.69,23.5 61.59,21.59 J5.P3
N$11
  Top 0.254: IC4.2 30.48,61.28 30.69,61.06 C20.1 R34.2 R36.1 R38.1
N$12
  Top 0.254: LED4.1 63.4,98.64 R10.1
N$13
  Top 0.254: IC5.47 65.05,61.78 C19.1
N$14
  Top 0.254: R32.2 25.08,32.7 30.16,27.62 31.43,27.62 32.39,26.67 32.39,22.86 33.66,21.59 33.66,19.68 34.29,19.05 43.82,19.05 45.09,20.32 45.09,21.27 46.36,22.54 47.62,22.54 48.9,21.27 48.9,5.71 47.62,4.45 33.02,4.45 32.39,5.08 J9.P3
N$15
  Top 0.254: R39.1 R37.1 R35.2 C21.1 35.34,61.06 35.56,61.28 IC4.6
N$16
  Top 0.254: LED3.1 52.76,98.64 R8.1
N$17
  Top 0.254: IC8.16 69.82,37.36 C34.1 75.05,37.36 C35.+
N$18
  Top 0.254: R55.1 R56.2 | R56.2 C44.1 | R56.2 C37.-
N$19
  Top 0.254: IC5.31 54.41,56.48 C24.1
N$20
  Top 0.254: R58.2 15.88,8.89 17.78,6.99 J8.P3
N$21
  Top 0.254: 15.24,3.17 23.49,3.17 25.4,5.08 J8.P2 | R57.2 5.71,24.45 6.67,23.5 13.97,23.5 15.24,22.23 15.24,3.17 | 15.24,3.17 5.08,3.17 3.17,5.08 J7.P3
N$22
  Top 0.254: R53.1 R54.2 | R54.2 C43.1 | R54.2 C36.-
N$23
  Top 0.254: R52.2 53.98,30.48 55.14,31.65 R50.2 | R50.2 55.66,31.75 | R50.2 56.94,31.65 57.79,30.8 C41.-
N$24
  Top 0.254: R33.1 R32.1 24.13,60.54 | 24.13,60.54 C22.1 R31.2 | 24.13,60.54 IC3.2
N$25
  Top 0.254: IC10.6 50.16,30.8 50.48,30.48 R52.1 51.75,30.58 C42.1 R48.2
N$26
  Top 0.254: R43.P$2 33.02,46.99 26.67,53.34 R33.2
N$27
  Top 0.254: R29.2 26.99,72.71 26.04,73.66 20.64,73.66 19.37,72.39 13.65,72.39 12.38,71.12 12.38,61.91 24.45,49.85 24.45,32.38 29.84,26.99 31.11,26.99 31.75,26.35 31.75,22.54 32.39,21.91 J3.P3
N$28
  Top 0.254: R48.1 C42.2 51.02,33.87 50.8,33.66 50.8,32.7 50.16,32.07 IC10.7 47.62,32.07 47.31,31.75 47.31,28.89 47.62,28.57 52.07,28.57 52.71,27.94 75.56,27.94 78.1,25.4 78.1,17.78 75.03,14.71 R62.2
N$29
  Top 0.254: LED3.3 47.68,98.64 R7.1
N$30
  Top 0.254: R28.1 R29.1 | IC3.6 R28.1 | R28.1 25.18,70.48 24.76,70.48 24.45,70.8 24.45,71.75 24.23,71.97 R27.2 C9.1
N$31
  Top 0.254: R59.2 R51.2 39.05,30.48 38.73,30.8 38.73,34.61 39.53,35.4 43.66,35.4 45.72,37.47 49.53,37.47 51.75,35.24 56.2,35.24 57.15,34.29 57.15,33.35 C33.-
N$32
  Top 0.254: R49.2 C40.1 | R51.1 41.59,30.48 41.49,30.58 R49.2 | R49.2 IC10.2
N$33
  Top 0.254: R49.1 C40.2 39.79,34.08 40.32,34.61 43.18,34.61 43.82,33.97 43.82,33.4 IC10.1 45.09,33.34 46.67,31.75 46.67,28.57 47.31,27.94 51.75,27.94 52.39,27.3 75.25,27.3 77.47,25.08 77.47,18.1 71.44,12.06 R61.2
N$34
  Top 0.254: LED2.1 42.12,98.64 R6.1
N$35
  Top 0.254: R18.P$2 16.51,71.44 16.83,71.75 19.68,71.75 20.95,73.03 25.08,73.03 25.4,72.71 R28.2
N$36  (via drill 0.6)
  Top 0.254: R15.1 67.73,89.11 66.67,90.17 66.67,92.39 66.99,92.71 66.99,100.33 64.45,102.87 7.94,102.87 6.35,101.28 6.35,99.38 3.49,96.52 3.49,94.3 1.91,92.71 1.91,25.08 4.45,22.54 4.45,20 6.35,18.1 v13.97,18.1
  Bottom 0.254: v13.97,18.1 16.51,18.1 17.78,19.37 J2.P3
N$37
  Top 0.254: R15.2 Q2.B
N$38
  Top 0.254: R2.2 R1.2 16.72,96.84 13.65,96.84 12.7,97.79 SW1.L1
N$39
  Top 0.254: LED2.3 37.05,98.64 R5.1
N$40
  Top 0.254: R3.1 23.97,95.89 24.61,95.25 LED1.1
N$41
  Top 0.254: LED1.3 29.79,98.64 R4.1
N$42  (via drill 0.6)
  Top 0.254: v11.43,32.38 IC9.7 | R53.2 78.42,26.04 78.74,25.72 78.74,9.21 78.42,8.89 78.42,4.76 76.83,3.17 31.11,3.17 29.53,4.76 29.53,8.89 19.37,19.05 19.37,24.45 17.46,26.35 v17.46,32.38 17.46,34.63 14.81,37.29 14.81,39.17 14.61,39.37 14.59,39.35 VR1.3B VR1.2B
  Bottom 0.254: v17.46,32.38 v11.43,32.38
N$43
  Top 0.254: IC1.15 50.01,89.85 50.64,90.49 52.86,90.49 56.04,93.66 62.23,93.66 64.45,95.89 R10.2
N$44
  Top 0.254: IC1.1 51.28,93.66 52.23,94.61 54.29,94.61 55.56,95.89 R9.2
N$45
  Top 0.254: IC1.2 50.01,93.66 51.59,95.25 53.18,95.25 53.82,95.89 R8.2
N$46
  Top 0.254: R7.2 44.93,96.2 45.24,95.89 46.51,95.89 48.74,93.66 IC1.3
N$47
  Top 0.254: R6.2 43.18,96.2 44.13,95.25 45.88,95.25 47.47,93.66 IC1.4
N$48
  Top 0.254: IC1.5 46.2,93.66 45.24,94.61 40.32,94.61 39.37,93.66 36.51,93.66 34.29,95.89 R5.2
N$49
  Top 0.254: IC1.6 44.93,91.12 44.29,90.49 40.64,90.49 39.37,91.76 35.88,91.76 33.66,93.98 27.62,93.98 26.99,94.61 24.45,94.61 23.02,96.04 23.02,98.42 23.23,98.64 R3.2
N$50
  Top 0.254: R4.2 32.54,96.52 36.04,93.03 39.69,93.03 40.64,93.98 43.34,93.98 43.66,93.66 IC1.7
N$51  (via drill 0.6)
  Top 0.254: R55.2 83.18,26.99 82.55,26.35 82.55,20 79.38,16.83 79.38,9.53 v79.69,9.21 | v77.47,9.21 77.79,8.89 77.79,5.08 76.52,3.81 31.43,3.81 30.16,5.08 30.16,9.21 20,19.37 20,24.77 18.1,26.67 18.1,31.43 18.41,31.75 18.41,33.02 18.1,33.34 18.1,34.61 15.24,37.47 v15.24,40.64 15.24,41.27 14.61,41.91 14.59,41.9 VR1.3 VR1.2 | IC9.1 8.2,34.35 v7.3,35.24
  Bottom 0.254: v77.47,9.21 v79.69,9.21 | v7.3,35.24 7.3,37.15 7.62,37.47 14.61,37.47 15.24,38.1 v15.24,40.64
N$52
  Top 0.254: VR1.1 6.33,41.9 5.71,41.27 R46.1
N$54
  Top 0.254: R47.2 R58.1 15.03,30.7 14.61,31.11 IC9.6
N$55
  Top 0.406: R11.2 21.59,93.98 22.54,93.03 C2.+ 22.68,91.44 25.4,91.44 26.63,90.21 IC2.2
N$56  (via drill 0.6)
  Top 0.406: D1.A 11.11,86.04 v11.11,80.96 | JP3.1 JP3.2
  Bottom 0.406: JP3.2 9.84,79.69 v11.11,80.96
N$57
  Top 0.254: R12.1 67.73,92.61 67.63,92.71 67.63,100.65 64.77,103.5 6.35,103.5 1.27,98.42 1.27,24.45 3.17,22.54 J1.P3
N$58
  Top 0.254: R57.1 R46.2 5.93,32.38 IC9.2
N$59
  Top 0.254: IC8.26 71.19,43.89 75.88,48.58 75.88,51.12 71.12,55.88 71.12,56.9 Q4.1 71.22,57.3 71.38,57.46 C47.2
N$60
  Top 0.254: IC8.25 71.5,43.24 76.52,48.26 76.52,51.12 81.03,55.63 Q4.2 81.18,57.3 81.02,57.46 C48.2
N$64
  Top 0.406: JP3.9 JP3.10 8.57,89.85 9.53,88.9 9.53,78.74 6.04,75.25 D2.C
N$66
  Top 0.254: R12.2 Q1.B
PITCH_POT  (via drill 0.6)
  Top 0.254: v71.75,65.41 71.44,65.09 65.09,65.09 64.45,64.45 57.43,64.45 IC5.9
  Bottom 0.254: v71.75,65.41 R20.P$2
PLAY
  Top 0.254: R16.1 Q2.C 73.66,87.14 73.66,85.72 70.48,82.55 70.48,75.88 68.26,73.66 65.93,73.66 IC5.58
POSITION_POT_CV
  Top 0.254: C9.2 R27.1 23.49,70.17 24.13,69.53 IC3.7 24.13,66.67 25.08,65.72 44.13,65.72 44.77,66.36 50.58,66.36 IC5.16 50.89,66.04
REC
  Top 0.254: R14.1 Q1.C 73.66,90.64 73.66,88.9 73.34,88.58 72.39,88.58 72.39,85.41 69.85,82.87 69.85,76.2 67.94,74.3 65.86,74.3 IC5.59
RESET  (via drill 0.6)
  Top 0.254: 86.14,77.79 SW5.B' 86.04,73.97 86.04,72.07 87.63,70.48 87.63,64.45 87.31,64.14 85.41,64.14 85.09,64.45 JP2.10 | 86.14,77.79 SW5.B | 80.01,77.79 80.01,75.88 75.88,71.75 67.94,71.75 66.36,70.17 v66.36,67.94 | IC5.7 57.79,65.51 v57.79,65.41 | 80.01,77.79 R17.1 | 80.01,77.79 86.14,77.79
  Bottom 0.254: v66.36,67.94 63.82,65.41 61.91,65.41 61.28,64.77 58.42,64.77 v57.79,65.41
RIN
  Top 0.254: C36.+ 80.01,38.42 79.09,39.34 IC8.19
ROUT
  Top 0.254: IC8.13 61.2,37.39 60.96,37.15 60.96,35.56 61.28,35.24 67.31,35.24 67.64,34.91 C41.+
ROUT_JACK
  Top 0.254: J12.P3 76.2,10.16 76.73,10.69 R62.1
RX
  Top 0.254: IC5.43 65.58,58.42 66.67,58.42 68.1,59.85 68.1,60.8 70.48,63.18 83.82,63.18 84.77,62.23 86.36,62.23 86.99,61.59 86.99,53.98 86.36,53.34 JP1.4
SIZE_CV
  Top 0.254: R25.1 C10.2 28.99,69.75 29.21,69.53 IC4.14 29.21,67.31 30.16,66.36 43.82,66.36 44.45,66.99 50.65,66.99 IC5.15
SIZE_POT
  Top 0.254: R19.P$2 44.13,71.44 46.36,73.66 50.16,73.66 53.02,70.8 53.02,69.57 IC5.8
SW_LOAD
  Top 0.254: IC5.51 65.41,68.18 65.41,70.17 67.63,72.39 68.9,72.39 71.75,75.25 71.75,81.92 75.25,85.41 78.1,85.41 78.66,85.97 SW3.3 SW3.4
SW_MODE  (via drill 0.6)
  Top 0.254: IC5.52 64.77,68.25 64.77,70.48 67.31,73.03 68.58,73.03 71.12,75.56 71.12,82.23 74.93,86.04 77.47,86.04 78.1,86.68 78.1,93.34 v77.79,93.66 | SW2.4 SW2.3
  Bottom 0.254: v77.79,93.66 75.92,95.53 SW2.4
SW_REC
  Top 0.254: SW1.P5 SW1.P2 9.56,102.23 63.82,102.23 66.36,99.69 66.36,93.03 66.04,92.71 66.04,89.53 66.67,88.9 66.67,79.06 65.41,77.79 65.41,75.25 IC5.61
TEXTURE_CV
  Top 0.254: R26.1 C11.2 37.05,69.75 36.83,69.53 IC4.8 36.83,67.31 37.15,66.99 43.5,66.99 44.13,67.63 50.72,67.63 IC5.14
TEXTURE_POT
  Top 0.254: IC5.22 50.16,58.6 50.16,52.07 53.34,48.9 53.34,46.99 55.25,45.09 R44.P$2
TX
  Top 0.254: IC5.42 65.35,57.94 66.83,57.94 68.58,59.69 68.58,60.64 70.64,62.71 81.76,62.71 84.14,60.33 84.14,51.12 84.45,50.8 JP1.5
V_OCT
  Top 0.254: R34.1 C20.2 28.99,61.06 29.21,61.28 IC4.1 29.21,63.5 30.16,64.45 43.82,64.45 47.31,60.96 51.11,60.96 IC5.20
VCC  (via drill 0.6)
  Top 0.406: IC9.8 13.34,33.72 13.28,33.66 12.38,33.66 11.64,34.39 C38.1 v13.34,35.24 | v2.86,33.97 3.49,34.61 3.49,41.27 8.57,46.35 v8.57,51.12 8.57,52.7 3.17,58.1 3.17,90.49 4.45,91.76 14.92,91.76 15.38,91.3 C1.+ | v45.4,15.24 41.91,15.24 41.59,15.56 32.7,15.56 29.37,18.89 29.37,22.7 20.95,31.11 20.95,36.83 11.43,46.35 11.43,49.21 v10.79,49.85 | v48.9,36.2 48.79,36.09 C39.1 48.79,33.5 IC10.8 | v48.9,39.05 47.92,40.03 IC7.3 | D1.C 13.97,89.85 15.42,91.3 C1.+ | C1.+ 15.74,91.48 | R11.1 16.51,93.98 15.56,93.03 C1.+
  Bottom 0.406: v2.86,33.97 12.06,33.97 v13.34,35.24 | v45.4,15.24 45.4,22.86 48.9,26.35 v48.9,36.2 v48.9,39.05 | v10.79,49.85 9.53,51.12 v8.57,51.12
VEE  (via drill 0.6)
  Top 0.406: IC9.4 8.2,28.95 8.89,28.26 C45.2 9.84,28.16 v9.84,26.67 | v4.13,27.94 4.13,40.96 9.68,46.51 9.68,52.55 | 5.71,62.76 5.29,62.76 4.13,61.59 4.13,58.1 9.68,52.55 | 5.71,62.76 R30.1 | 5.71,62.76 C13.- 5.86,65.41 7.62,65.41 8.89,66.67 8.89,72.39 9.84,73.34 D2.A | 9.68,52.55 12.06,50.16 12.06,46.67 21.59,37.15 21.59,31.43 30.16,22.86 30.16,19.05 33.02,16.19 v44.13,16.19 | IC10.4 43.76,28.09 C46.2 43.6,26.14 44.02,25.72 v44.13,25.72
  Bottom 0.406: v4.13,27.94 8.57,27.94 v9.84,26.67 | v44.13,16.19 v44.13,25.72

### Text on the board
tNames: SYSBOOT | RESET | board revision by Matt Gaines, 2018 | Cirrus | cc-by-sa Olivier Gillet, 2015. v3
bNames: Red Stripe | -12V | Cirrus | GND | GND | GND | +12V | JTAG | GND | <TX | FTDI DONGLE | board revision by Matt Gaines, 2018 | cc-by-sa Olivier Gillet, 2015. v3